# Altium project fMUX_MB.PrjPCB (part 1 of 6)
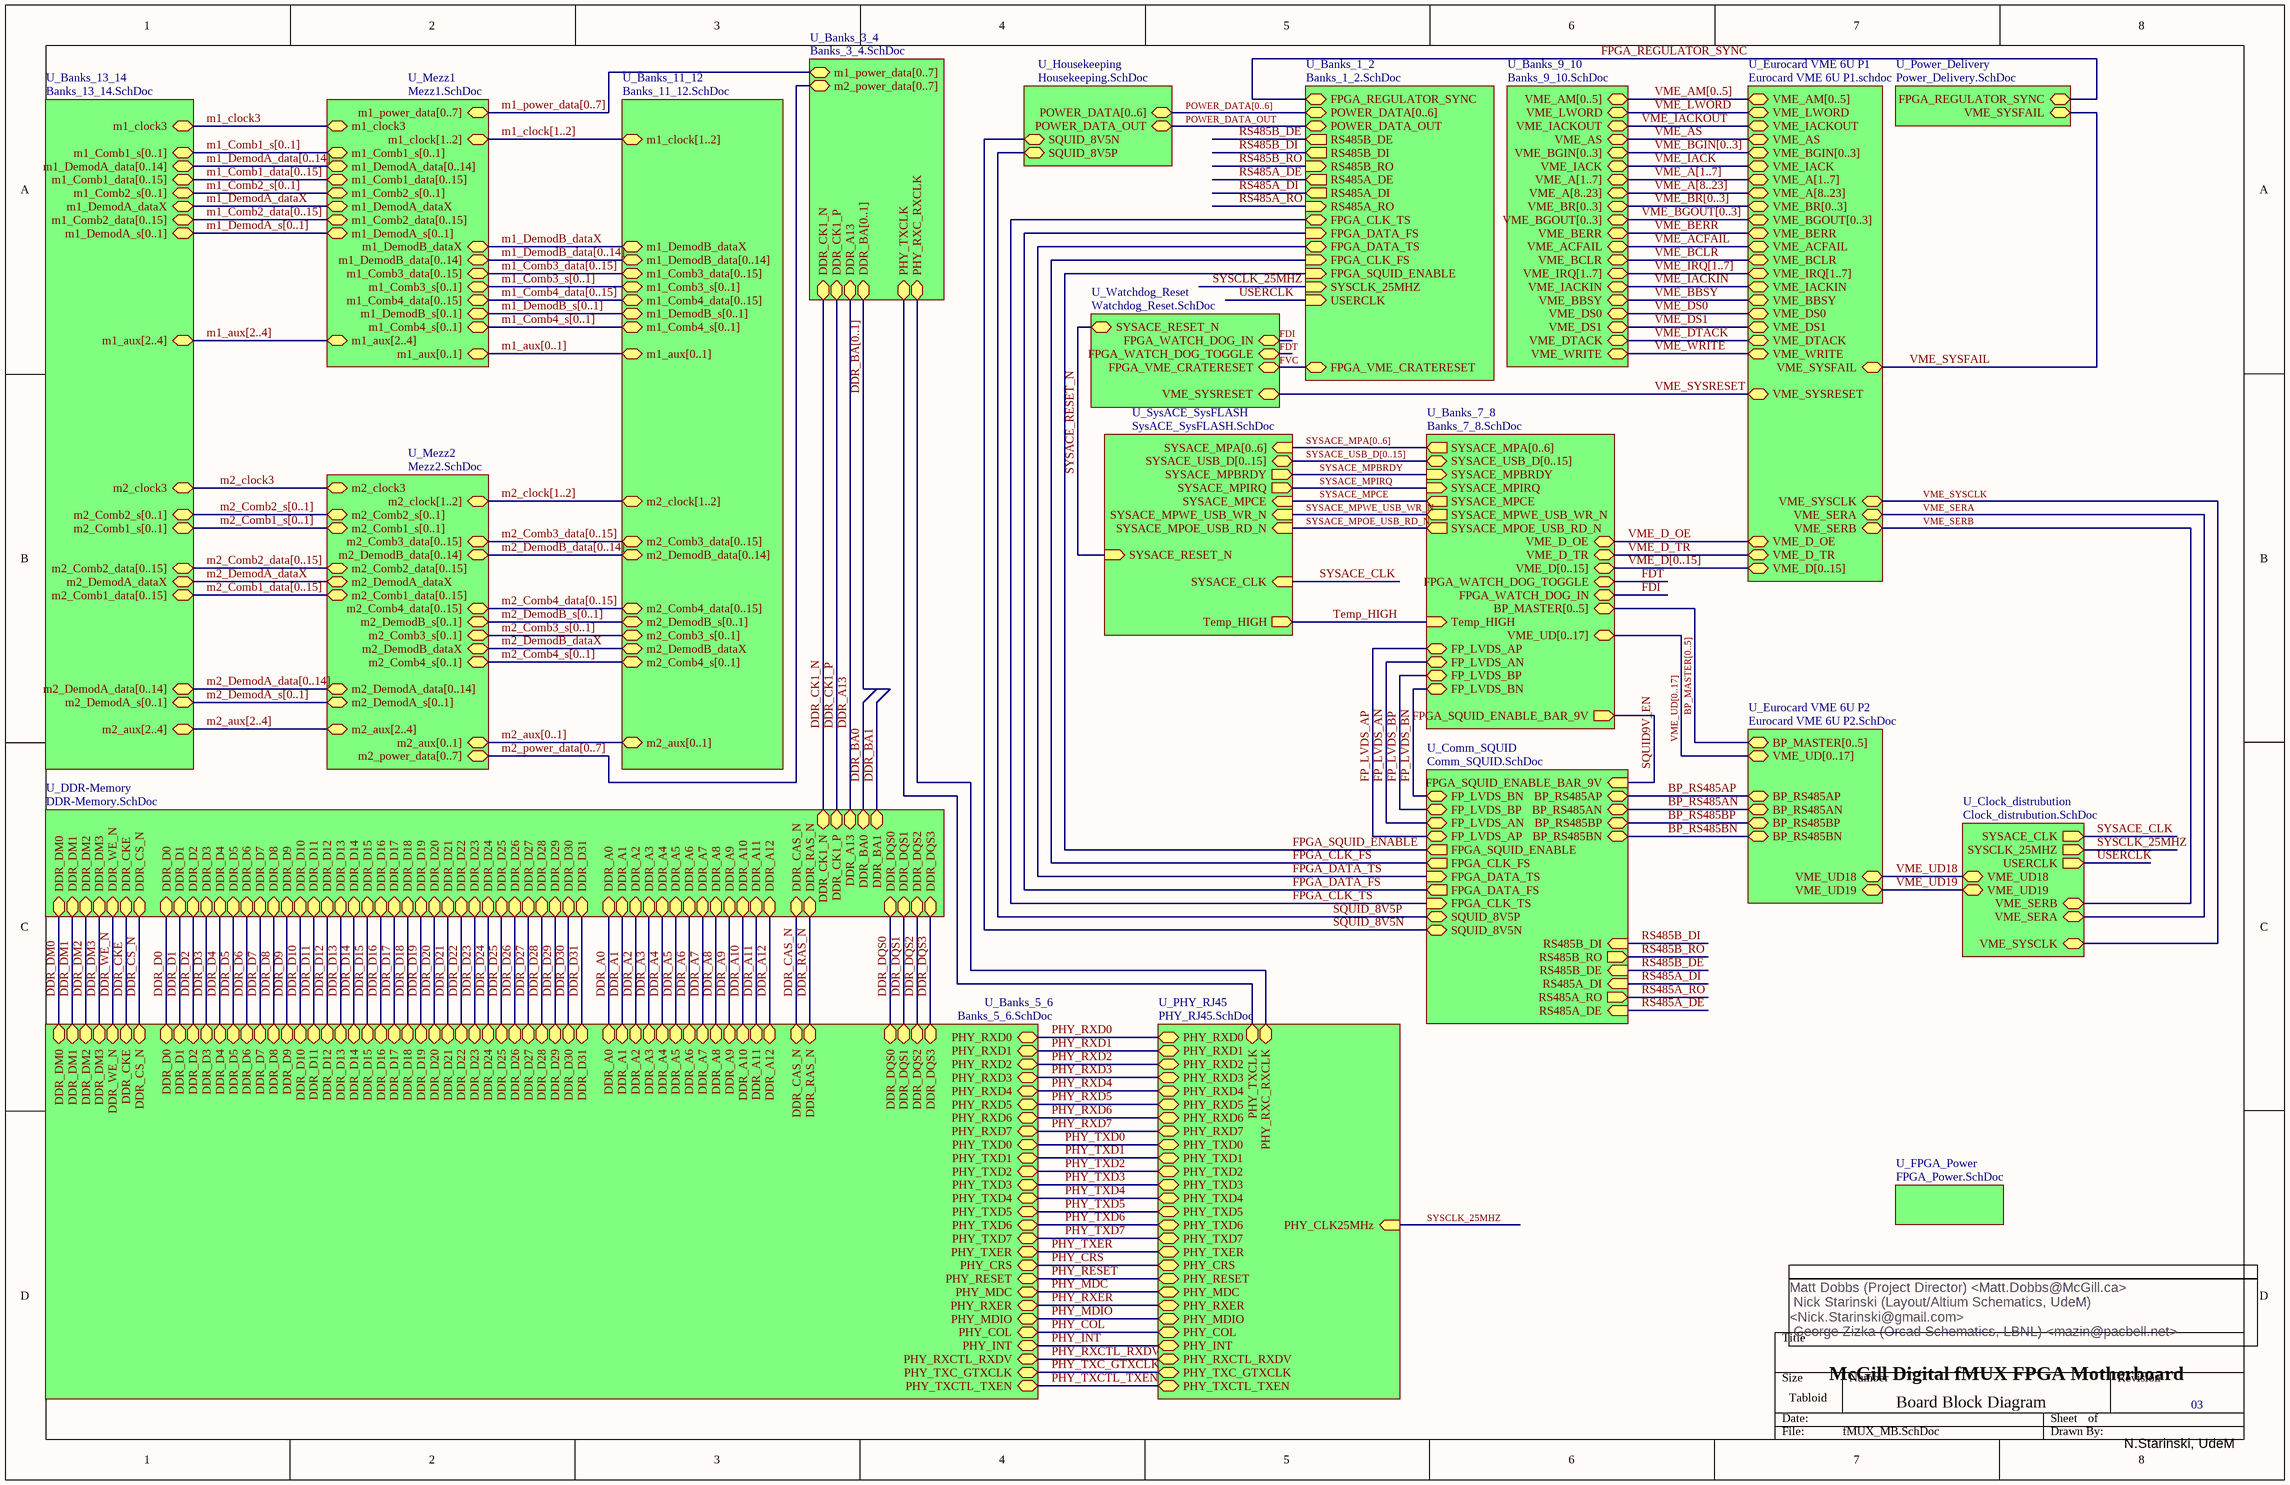
[diagram p0: fMUX_MB.SchDoc]
28 sheets, 672 parts. Net scope: hierarchical (ports join the sheet entries above them; power ports are global).
Board file: fMAX_MB.PcbDoc
Sheets:
  fMUX_MB.SchDoc
    U_Banks_1_2 = Banks_1_2.SchDoc
    U_Banks_3_4 = Banks_3_4.SchDoc
    U_Banks_5_6 = Banks_5_6.SchDoc
    U_Banks_7_8 = Banks_7_8.SchDoc
    U_Banks_9_10 = Banks_9_10.SchDoc
    U_Banks_11_12 = Banks_11_12.SchDoc
    U_Banks_13_14 = Banks_13_14.SchDoc
    U_Power_Delivery = Power_Delivery.SchDoc
      BuckRegulator1 = Buck_regulator.SchDoc
      BuckRegulator2 = Buck_regulator.SchDoc
      BuckRegulator3 = Buck_regulator.SchDoc
      Liner_Pos_Regulator = Linear_Pos_regulator.SchDoc
    U_Clock_distrubution = Clock_distrubution.SchDoc
      UserCLK = UserClock.SchDoc
    U_DDR-Memory = DDR-Memory.SchDoc
      RTerm1 = RTerm.SchDoc
      RTerm2 = RTerm.SchDoc
      RTerm3 = RTerm.SchDoc
      RTerm4 = RTerm.SchDoc
      RTerm5 = RTerm.SchDoc
      RTerm6 = RTerm.SchDoc
      RTerm7 = RTerm.SchDoc
      RTerm8 = RTerm.SchDoc
    U_Eurocard VME 6U P1 = Eurocard VME 6U P1.schdoc
    U_Eurocard VME 6U P2 = Eurocard VME 6U P2.SchDoc
    U_FPGA_Power = FPGA_Power.SchDoc
    U_Housekeeping = Housekeeping.SchDoc
      TemperatureSens1 = TermperatureSens.SchDoc
      TemperatureSens2 = TermperatureSens.SchDoc
      TemperatureSens3 = TermperatureSens.SchDoc
    U_Mezz1 = Mezz1.SchDoc
    U_Mezz2 = Mezz2.SchDoc
    U_SysACE_SysFLASH = SysACE_SysFLASH.SchDoc
    U_Watchdog_Reset = Watchdog_Reset.SchDoc
    U_Comm_SQUID = Comm_SQUID.SchDoc
      U_SQUID_Power = SQUID_Power.SchDoc
    U_PHY_RJ45 = PHY_RJ45.SchDoc
  fMuxBoardOverview.SchDoc

## Sheet fMUX_MB.SchDoc: FPGA Motherboard for Digital Multiplexed Readout, McGill U.
size Tabloid; DocumentNumber: DfMUX1; Revision: Rev0, Prototype; SheetNumber: 1; SheetTotal: 27; PageSetup: Record=PageOptions|CenterHorizontal=True|CenterVertical=True|PrintScale=0.72|XCorrection=1.00|YCorrection=1.00|PrintKind=0|BorderSize=5000000|LeftOffset=0|BottomOffset=0|Orientation=2|PaperLength=1000|PaperWidth=1000|Scale=100|PaperSource=7|PrintQuality=-4|MediaType=1|DitherType=10|PaperKind=Letter|PrintScaleMode=1

### Sub-sheets
U_Banks_1_2 = Banks_1_2.SchDoc: POWER_DATA[0..6], POWER_DATA_OUT (bidir), RS485B_RO (in), RS485B_DE (out), FPGA_SQUID_ENABLE (in), SYSCLK_25MHZ (in), USERCLK (in), FPGA_VME_CRATERESET (bidir), RS485A_DE (out), FPGA_REGULATOR_SYNC (bidir), FPGA_DATA_FS (in), FPGA_CLK_TS (bidir), FPGA_DATA_TS (bidir), RS485A_DI (out), FPGA_CLK_FS (in), RS485B_DI (out), RS485A_RO (in)
U_Banks_3_4 = Banks_3_4.SchDoc: m1_power_data[0..7], m2_power_data[0..7] (bidir), DDR_A13 (bidir), DDR_CK1_P (bidir), PHY_TXCLK (bidir), DDR_CK1_N (bidir), PHY_RXC_RXCLK (bidir), DDR_BA[0..1] (bidir)
U_Banks_5_6 = Banks_5_6.SchDoc: DDR_D0 (bidir), DDR_D2 (bidir), DDR_D6 (bidir), DDR_D3 (bidir), DDR_D8 (bidir), DDR_D1 (bidir), DDR_D9 (bidir), DDR_D7 (bidir), DDR_D11 (bidir), DDR_D12 (bidir), DDR_D13 (bidir), DDR_D29 (bidir), DDR_A1 (bidir), DDR_D4 (bidir), DDR_D5 (bidir), DDR_D16 (bidir), DDR_DQS3 (bidir), DDR_DM2 (bidir), DDR_DQS2 (bidir), DDR_D15 (bidir), DDR_D18 (bidir), DDR_D19 (bidir), DDR_D20 (bidir), DDR_A7 (bidir), DDR_A8 (bidir), DDR_A11 (bidir), DDR_D10 (bidir), DDR_D17 (bidir), DDR_A12 (bidir), DDR_DM0 (bidir), DDR_DQS1 (bidir), DDR_A2 (bidir), DDR_CAS_N (bidir), DDR_A9 (bidir), DDR_DM3 (bidir), DDR_DQS0 (bidir), DDR_RAS_N (bidir), DDR_DM1 (bidir), DDR_D14 (bidir), DDR_A4 (bidir), DDR_A5 (bidir), DDR_A10 (bidir), DDR_WE_N (bidir), DDR_D21 (bidir), DDR_D22 (bidir), DDR_D23 (bidir), DDR_D24 (bidir), DDR_A6 (bidir), DDR_A3 (bidir), DDR_D26 (bidir), DDR_D31 (bidir), DDR_A0 (bidir), DDR_D27 (bidir), DDR_D28 (bidir), DDR_D30 (bidir), DDR_D25 (bidir), PHY_TXD6 (bidir), PHY_RXD0 (bidir), PHY_RXD2 (bidir), PHY_RXD7 (bidir), PHY_MDIO (bidir), PHY_TXCTL_TXEN (bidir), PHY_RXD4 (bidir), PHY_RXD5 (bidir), PHY_RXD6 (bidir), PHY_TXER (bidir), PHY_MDC (bidir), PHY_COL (bidir), PHY_RXD3 (bidir), PHY_RXER (bidir), PHY_TXD1 (bidir), PHY_TXD3 (bidir), PHY_RXD1 (bidir), PHY_RXCTL_RXDV (bidir), PHY_CRS (bidir), PHY_TXC_GTXCLK (bidir), PHY_RESET (bidir), PHY_TXD0 (bidir), PHY_TXD5 (bidir), PHY_TXD2 (bidir), PHY_TXD4 (bidir), PHY_TXD7 (bidir), PHY_INT (bidir), DDR_CS_N (bidir), DDR_CKE (bidir)
U_Banks_7_8 = Banks_7_8.SchDoc: BP_MASTER[0..5], FP_LVDS_BP (bidir), VME_D[0..15] (bidir), FP_LVDS_BN (bidir), FP_LVDS_AP (bidir), FP_LVDS_AN (bidir), VME_UD[0..17] (bidir), SYSACE_MPA[0..6] (out), SYSACE_USB_D[0..15], VME_D_OE (bidir), SYSACE_MPIRQ (in), SYSACE_MPCE (out), VME_D_TR (bidir), SYSACE_MPBRDY (in), SYSACE_MPOE_USB_RD_N (out), SYSACE_MPWE_USB_WR_N (out), Temp_HIGH (in), FPGA_WATCH_DOG_TOGGLE (bidir), FPGA_WATCH_DOG_IN (bidir), FPGA_SQUID_ENABLE_BAR_9V (out)
U_Banks_9_10 = Banks_9_10.SchDoc: VME_AM[0..5] (bidir), VME_LWORD (bidir), VME_IACKOUT (bidir), VME_AS (bidir), VME_BGIN[0..3] (bidir), VME_IACK (bidir), VME_A[8..23] (bidir), VME_BR[0..3] (bidir), VME_BGOUT[0..3] (bidir), VME_BERR (bidir), VME_A[1..7] (bidir), VME_ACFAIL (bidir), VME_BCLR (bidir), VME_IRQ[1..7] (bidir), VME_IACKIN (bidir), VME_BBSY (bidir), VME_DS0 (bidir), VME_DS1 (bidir), VME_DTACK (bidir), VME_WRITE (bidir)
U_Banks_11_12 = Banks_11_12.SchDoc: m1_Comb3_s[0..1] (bidir), m2_Comb3_s[0..1] (bidir), m1_Comb4_s[0..1] (bidir), m2_Comb4_s[0..1] (bidir), m2_DemodB_data[0..14] (bidir), m1_DemodB_data[0..14] (bidir), m1_Comb4_data[0..15] (bidir), m1_Comb3_data[0..15] (bidir), m2_Comb3_data[0..15] (bidir), m2_Comb4_data[0..15] (bidir), m2_aux[0..1] (bidir), m1_DemodB_s[0..1] (bidir), m2_DemodB_s[0..1] (bidir), m1_clock[1..2] (bidir), m1_DemodB_dataX (bidir), m2_DemodB_dataX (bidir), m2_clock[1..2] (bidir), m1_aux[0..1] (bidir)
U_Banks_13_14 = Banks_13_14.SchDoc: m2_DemodA_s[0..1] (bidir), m1_clock3 (bidir), m1_DemodA_data[0..14] (bidir), m2_Comb1_data[0..15] (bidir), m1_DemodA_s[0..1] (bidir), m1_Comb2_data[0..15] (bidir), m2_Comb1_s[0..1] (bidir), m1_aux[2..4] (bidir), m2_Comb2_data[0..15] (bidir), m2_Comb2_s[0..1] (bidir), m2_aux[2..4] (bidir), m1_Comb1_data[0..15] (bidir), m1_Comb2_s[0..1] (bidir), m1_Comb1_s[0..1] (bidir), m1_DemodA_dataX (bidir), m2_DemodA_dataX (bidir), m2_DemodA_data[0..14] (bidir), m2_clock3 (bidir)
U_Clock_distrubution = Clock_distrubution.SchDoc: SYSACE_CLK (out), SYSCLK_25MHZ (out), USERCLK (out), VME_UD18 (bidir), VME_UD19 (bidir), VME_SYSCLK (bidir), VME_SERA (bidir), VME_SERB (bidir)
U_Comm_SQUID = Comm_SQUID.SchDoc: BP_RS485BP (bidir), BP_RS485BN (bidir), BP_RS485AP (bidir), BP_RS485AN (bidir), FP_LVDS_BN (bidir), FP_LVDS_BP (bidir), FP_LVDS_AN (bidir), FP_LVDS_AP (bidir), FPGA_CLK_TS (in), FPGA_DATA_FS (out), FPGA_CLK_FS (out), SQUID_8V5N, FPGA_DATA_TS (in), RS485B_DE (in), RS485B_RO (out), RS485A_DE (in), RS485A_RO (out), SQUID_8V5P, RS485A_DI (in), FPGA_SQUID_ENABLE (out), RS485B_DI (in), FPGA_SQUID_ENABLE_BAR_9V (in)
U_DDR-Memory = DDR-Memory.SchDoc: DDR_A11 (bidir), DDR_D27 (bidir), DDR_D7 (bidir), DDR_A8 (bidir), DDR_D25 (bidir), DDR_A7 (bidir), DDR_A6 (bidir), DDR_DM0 (bidir), DDR_DM1 (bidir), DDR_D20 (bidir), DDR_DQS2 (bidir), DDR_DQS3 (bidir), DDR_D16 (bidir), DDR_D8 (bidir), DDR_D13 (bidir), DDR_D0 (bidir), DDR_A4 (bidir), DDR_D19 (bidir), DDR_A2 (bidir), DDR_A12 (bidir), DDR_D28 (bidir), DDR_D30 (bidir), DDR_A13 (bidir), DDR_A5 (bidir), DDR_D10 (bidir), DDR_A10 (bidir), DDR_D12 (bidir), DDR_D31 (bidir), DDR_DM3 (bidir), DDR_D14 (bidir), DDR_D29 (bidir), DDR_D21 (bidir), DDR_D24 (bidir), DDR_D6 (bidir), DDR_D11 (bidir), DDR_D5 (bidir), DDR_D15 (bidir), DDR_D4 (bidir), DDR_D18 (bidir), DDR_D2 (bidir), DDR_D9 (bidir), DDR_A3 (bidir), DDR_A0 (bidir), DDR_CK1_N (bidir), DDR_D3 (bidir), DDR_D23 (bidir), DDR_D26 (bidir), DDR_D17 (bidir), DDR_A1 (bidir), DDR_DM2 (bidir), DDR_A9 (bidir), DDR_D1 (bidir), DDR_BA0 (bidir), DDR_DQS1 (bidir), DDR_CAS_N (bidir), DDR_CS_N (bidir), DDR_CKE (bidir), DDR_WE_N (bidir), DDR_BA1 (bidir), DDR_D22 (bidir), DDR_DQS0 (bidir), DDR_CK1_P (bidir), DDR_RAS_N (bidir)
U_Eurocard VME 6U P1 = Eurocard VME 6U P1.schdoc: VME_DTACK (bidir), VME_BGIN[0..3] (bidir), VME_BCLR (bidir), VME_IACKIN (bidir), VME_BGOUT[0..3] (bidir), VME_IRQ[1..7] (bidir), VME_BBSY (bidir), VME_BR[0..3] (bidir), VME_DS1 (bidir), VME_ACFAIL (bidir), VME_A[1..7] (bidir), VME_IACK (bidir), VME_AM[0..5] (bidir), VME_D[0..15] (bidir), VME_BERR (bidir), VME_LWORD (bidir), VME_IACKOUT (bidir), VME_A[8..23] (bidir), VME_WRITE (bidir), VME_AS (bidir), VME_DS0 (bidir), VME_SYSFAIL (bidir), VME_D_OE (bidir), VME_SYSRESET (bidir), VME_D_TR (bidir), VME_SYSCLK (bidir), VME_SERA (bidir), VME_SERB (bidir)
U_Eurocard VME 6U P2 = Eurocard VME 6U P2.SchDoc: BP_RS485BN (bidir), BP_MASTER[0..5], BP_RS485BP (bidir), BP_RS485AN (bidir), BP_RS485AP (bidir), VME_UD[0..17] (bidir), VME_UD18 (bidir), VME_UD19 (bidir)
U_FPGA_Power = FPGA_Power.SchDoc: no entries
U_Housekeeping = Housekeeping.SchDoc: POWER_DATA[0..6], POWER_DATA_OUT (bidir), SQUID_8V5N, SQUID_8V5P
U_Mezz1 = Mezz1.SchDoc: m1_power_data[0..7], m1_Comb1_s[0..1] (bidir), m1_DemodA_data[0..14] (bidir), m1_Comb1_data[0..15] (bidir), m1_DemodB_data[0..14] (bidir), m1_DemodB_dataX (bidir), m1_Comb4_s[0..1] (bidir), m1_Comb2_data[0..15] (bidir), m1_DemodB_s[0..1] (bidir), m1_DemodA_s[0..1] (bidir), m1_DemodA_dataX (bidir), m1_Comb3_data[0..15] (bidir), m1_Comb2_s[0..1] (bidir), m1_Comb3_s[0..1] (bidir), m1_Comb4_data[0..15] (bidir), m1_aux[2..4] (bidir), m1_clock[1..2] (bidir), m1_clock3 (bidir), m1_aux[0..1] (bidir)
U_Mezz2 = Mezz2.SchDoc: m2_power_data[0..7] (bidir), m2_Comb3_s[0..1] (bidir), m2_Comb2_data[0..15] (bidir), m2_DemodA_s[0..1] (bidir), m2_Comb4_s[0..1] (bidir), m2_Comb4_data[0..15] (bidir), m2_DemodB_s[0..1] (bidir), m2_DemodA_data[0..14] (bidir), m2_Comb2_s[0..1] (bidir), m2_Comb3_data[0..15] (bidir), m2_DemodB_data[0..14] (bidir), m2_Comb1_data[0..15] (bidir), m2_Comb1_s[0..1] (bidir), m2_DemodA_dataX (bidir), m2_DemodB_dataX (bidir), m2_clock[1..2] (bidir), m2_aux[2..4] (bidir), m2_clock3 (bidir), m2_aux[0..1] (bidir)
U_PHY_RJ45 = PHY_RJ45.SchDoc: PHY_RXD3 (bidir), PHY_RXD4 (bidir), PHY_RXD0 (bidir), PHY_RXD5 (bidir), PHY_RXD1 (bidir), PHY_RXD7 (bidir), PHY_RXD6 (bidir), PHY_RXD2 (bidir), PHY_RXC_RXCLK (bidir), PHY_TXCLK (bidir), PHY_TXD3 (bidir), PHY_TXD5 (bidir), PHY_MDC (bidir), PHY_TXER (bidir), PHY_CRS (bidir), PHY_TXC_GTXCLK (bidir), PHY_RXCTL_RXDV (bidir), PHY_TXCTL_TXEN (bidir), PHY_COL (bidir), PHY_TXD4 (bidir), PHY_TXD7 (bidir), PHY_RESET (bidir), PHY_INT (bidir), PHY_TXD2 (bidir), PHY_TXD1 (bidir), PHY_TXD6 (bidir), PHY_RXER (bidir), PHY_MDIO (bidir), PHY_TXD0 (bidir), PHY_CLK25MHz (in)
U_Power_Delivery = Power_Delivery.SchDoc: FPGA_REGULATOR_SYNC (bidir), VME_SYSFAIL (bidir)
U_SysACE_SysFLASH = SysACE_SysFLASH.SchDoc: SYSACE_MPCE (in), SYSACE_USB_D[0..15], SYSACE_MPIRQ (out), SYSACE_MPA[0..6] (in), SYSACE_MPBRDY (out), SYSACE_MPWE_USB_WR_N (in), SYSACE_MPOE_USB_RD_N (in), SYSACE_RESET_N (in), SYSACE_CLK (in), Temp_HIGH (out)
U_Watchdog_Reset = Watchdog_Reset.SchDoc: SYSACE_RESET_N (bidir), FPGA_WATCH_DOG_TOGGLE (bidir), VME_SYSRESET (bidir), FPGA_VME_CRATERESET (bidir), FPGA_WATCH_DOG_IN (bidir)

### Nets
BP_RS485AN: sheet U_Eurocard VME 6U P2/BP_RS485AN, sheet U_Comm_SQUID/BP_RS485AN
BP_RS485AP: sheet U_Eurocard VME 6U P2/BP_RS485AP, sheet U_Comm_SQUID/BP_RS485AP
BP_RS485BN: sheet U_Eurocard VME 6U P2/BP_RS485BN, sheet U_Comm_SQUID/BP_RS485BN
BP_RS485BP: sheet U_Eurocard VME 6U P2/BP_RS485BP, sheet U_Comm_SQUID/BP_RS485BP
DDR_A0: sheet U_Banks_5_6/DDR_A0, sheet U_DDR-Memory/DDR_A0
DDR_A1: sheet U_Banks_5_6/DDR_A1, sheet U_DDR-Memory/DDR_A1
DDR_A2: sheet U_Banks_5_6/DDR_A2, sheet U_DDR-Memory/DDR_A2
DDR_A3: sheet U_Banks_5_6/DDR_A3, sheet U_DDR-Memory/DDR_A3
DDR_A4: sheet U_Banks_5_6/DDR_A4, sheet U_DDR-Memory/DDR_A4
DDR_A5: sheet U_Banks_5_6/DDR_A5, sheet U_DDR-Memory/DDR_A5
DDR_A6: sheet U_Banks_5_6/DDR_A6, sheet U_DDR-Memory/DDR_A6
DDR_A7: sheet U_Banks_5_6/DDR_A7, sheet U_DDR-Memory/DDR_A7
DDR_A8: sheet U_Banks_5_6/DDR_A8, sheet U_DDR-Memory/DDR_A8
DDR_A9: sheet U_Banks_5_6/DDR_A9, sheet U_DDR-Memory/DDR_A9
DDR_A10: sheet U_Banks_5_6/DDR_A10, sheet U_DDR-Memory/DDR_A10
DDR_A11: sheet U_Banks_5_6/DDR_A11, sheet U_DDR-Memory/DDR_A11
DDR_A12: sheet U_Banks_5_6/DDR_A12, sheet U_DDR-Memory/DDR_A12
DDR_A13: sheet U_Banks_3_4/DDR_A13, sheet U_DDR-Memory/DDR_A13
DDR_CAS_N: sheet U_Banks_5_6/DDR_CAS_N, sheet U_DDR-Memory/DDR_CAS_N
DDR_CK1_N: sheet U_Banks_3_4/DDR_CK1_N, sheet U_DDR-Memory/DDR_CK1_N
DDR_CK1_P: sheet U_Banks_3_4/DDR_CK1_P, sheet U_DDR-Memory/DDR_CK1_P
DDR_CKE: sheet U_Banks_5_6/DDR_CKE, sheet U_DDR-Memory/DDR_CKE
DDR_CS_N: sheet U_Banks_5_6/DDR_CS_N, sheet U_DDR-Memory/DDR_CS_N
DDR_D0: sheet U_Banks_5_6/DDR_D0, sheet U_DDR-Memory/DDR_D0
DDR_D1: sheet U_Banks_5_6/DDR_D1, sheet U_DDR-Memory/DDR_D1
DDR_D2: sheet U_Banks_5_6/DDR_D2, sheet U_DDR-Memory/DDR_D2
DDR_D3: sheet U_Banks_5_6/DDR_D3, sheet U_DDR-Memory/DDR_D3
DDR_D4: sheet U_Banks_5_6/DDR_D4, sheet U_DDR-Memory/DDR_D4
DDR_D5: sheet U_Banks_5_6/DDR_D5, sheet U_DDR-Memory/DDR_D5
DDR_D6: sheet U_Banks_5_6/DDR_D6, sheet U_DDR-Memory/DDR_D6
DDR_D7: sheet U_Banks_5_6/DDR_D7, sheet U_DDR-Memory/DDR_D7
DDR_D8: sheet U_Banks_5_6/DDR_D8, sheet U_DDR-Memory/DDR_D8
DDR_D9: sheet U_Banks_5_6/DDR_D9, sheet U_DDR-Memory/DDR_D9
DDR_D10: sheet U_Banks_5_6/DDR_D10, sheet U_DDR-Memory/DDR_D10
DDR_D11: sheet U_Banks_5_6/DDR_D11, sheet U_DDR-Memory/DDR_D11
DDR_D12: sheet U_Banks_5_6/DDR_D12, sheet U_DDR-Memory/DDR_D12
DDR_D13: sheet U_Banks_5_6/DDR_D13, sheet U_DDR-Memory/DDR_D13
DDR_D14: sheet U_Banks_5_6/DDR_D14, sheet U_DDR-Memory/DDR_D14
DDR_D15: sheet U_Banks_5_6/DDR_D15, sheet U_DDR-Memory/DDR_D15
DDR_D16: sheet U_Banks_5_6/DDR_D16, sheet U_DDR-Memory/DDR_D16
DDR_D17: sheet U_Banks_5_6/DDR_D17, sheet U_DDR-Memory/DDR_D17
DDR_D18: sheet U_Banks_5_6/DDR_D18, sheet U_DDR-Memory/DDR_D18
DDR_D19: sheet U_Banks_5_6/DDR_D19, sheet U_DDR-Memory/DDR_D19
DDR_D20: sheet U_Banks_5_6/DDR_D20, sheet U_DDR-Memory/DDR_D20
DDR_D21: sheet U_Banks_5_6/DDR_D21, sheet U_DDR-Memory/DDR_D21
DDR_D22: sheet U_Banks_5_6/DDR_D22, sheet U_DDR-Memory/DDR_D22
DDR_D23: sheet U_Banks_5_6/DDR_D23, sheet U_DDR-Memory/DDR_D23
DDR_D24: sheet U_Banks_5_6/DDR_D24, sheet U_DDR-Memory/DDR_D24
DDR_D25: sheet U_Banks_5_6/DDR_D25, sheet U_DDR-Memory/DDR_D25
DDR_D26: sheet U_Banks_5_6/DDR_D26, sheet U_DDR-Memory/DDR_D26
DDR_D27: sheet U_Banks_5_6/DDR_D27, sheet U_DDR-Memory/DDR_D27
DDR_D28: sheet U_Banks_5_6/DDR_D28, sheet U_DDR-Memory/DDR_D28
DDR_D29: sheet U_Banks_5_6/DDR_D29, sheet U_DDR-Memory/DDR_D29
DDR_D30: sheet U_Banks_5_6/DDR_D30, sheet U_DDR-Memory/DDR_D30
DDR_D31: sheet U_Banks_5_6/DDR_D31, sheet U_DDR-Memory/DDR_D31
DDR_DM0: sheet U_Banks_5_6/DDR_DM0, sheet U_DDR-Memory/DDR_DM0
DDR_DM1: sheet U_Banks_5_6/DDR_DM1, sheet U_DDR-Memory/DDR_DM1
DDR_DM2: sheet U_Banks_5_6/DDR_DM2, sheet U_DDR-Memory/DDR_DM2
DDR_DM3: sheet U_Banks_5_6/DDR_DM3, sheet U_DDR-Memory/DDR_DM3
DDR_DQS0: sheet U_Banks_5_6/DDR_DQS0, sheet U_DDR-Memory/DDR_DQS0
DDR_DQS1: sheet U_Banks_5_6/DDR_DQS1, sheet U_DDR-Memory/DDR_DQS1
DDR_DQS2: sheet U_Banks_5_6/DDR_DQS2, sheet U_DDR-Memory/DDR_DQS2
DDR_DQS3: sheet U_Banks_5_6/DDR_DQS3, sheet U_DDR-Memory/DDR_DQS3
DDR_RAS_N: sheet U_Banks_5_6/DDR_RAS_N, sheet U_DDR-Memory/DDR_RAS_N
DDR_WE_N: sheet U_Banks_5_6/DDR_WE_N, sheet U_DDR-Memory/DDR_WE_N
FDI: sheet U_Banks_7_8/FPGA_WATCH_DOG_IN, sheet U_Watchdog_Reset/FPGA_WATCH_DOG_IN
FDT: sheet U_Banks_7_8/FPGA_WATCH_DOG_TOGGLE, sheet U_Watchdog_Reset/FPGA_WATCH_DOG_TOGGLE
FP_LVDS_AN: sheet U_Banks_7_8/FP_LVDS_AN, sheet U_Comm_SQUID/FP_LVDS_AN
FP_LVDS_AP: sheet U_Banks_7_8/FP_LVDS_AP, sheet U_Comm_SQUID/FP_LVDS_AP
FP_LVDS_BN: sheet U_Banks_7_8/FP_LVDS_BN, sheet U_Comm_SQUID/FP_LVDS_BN
FP_LVDS_BP: sheet U_Banks_7_8/FP_LVDS_BP, sheet U_Comm_SQUID/FP_LVDS_BP
FPGA_CLK_FS: sheet U_Banks_1_2/FPGA_CLK_FS, sheet U_Comm_SQUID/FPGA_CLK_FS
FPGA_CLK_TS: sheet U_Banks_1_2/FPGA_CLK_TS, sheet U_Comm_SQUID/FPGA_CLK_TS
FPGA_DATA_FS: sheet U_Banks_1_2/FPGA_DATA_FS, sheet U_Comm_SQUID/FPGA_DATA_FS
FPGA_DATA_TS: sheet U_Banks_1_2/FPGA_DATA_TS, sheet U_Comm_SQUID/FPGA_DATA_TS
FPGA_REGULATOR_SYNC: sheet U_Banks_1_2/FPGA_REGULATOR_SYNC, sheet U_Power_Delivery/FPGA_REGULATOR_SYNC
FPGA_SQUID_ENABLE: sheet U_Banks_1_2/FPGA_SQUID_ENABLE, sheet U_Comm_SQUID/FPGA_SQUID_ENABLE
FVC: sheet U_Banks_1_2/FPGA_VME_CRATERESET, sheet U_Watchdog_Reset/FPGA_VME_CRATERESET
m1_clock3: sheet U_Banks_13_14/m1_clock3, sheet U_Mezz1/m1_clock3
m1_DemodA_dataX: sheet U_Banks_13_14/m1_DemodA_dataX, sheet U_Mezz1/m1_DemodA_dataX
m1_DemodB_dataX: sheet U_Banks_11_12/m1_DemodB_dataX, sheet U_Mezz1/m1_DemodB_dataX
m2_clock3: sheet U_Banks_13_14/m2_clock3, sheet U_Mezz2/m2_clock3
m2_DemodA_dataX: sheet U_Banks_13_14/m2_DemodA_dataX, sheet U_Mezz2/m2_DemodA_dataX
m2_DemodB_dataX: sheet U_Banks_11_12/m2_DemodB_dataX, sheet U_Mezz2/m2_DemodB_dataX
PHY_COL: sheet U_Banks_5_6/PHY_COL, sheet U_PHY_RJ45/PHY_COL
PHY_CRS: sheet U_Banks_5_6/PHY_CRS, sheet U_PHY_RJ45/PHY_CRS
PHY_INT: sheet U_Banks_5_6/PHY_INT, sheet U_PHY_RJ45/PHY_INT
PHY_MDC: sheet U_Banks_5_6/PHY_MDC, sheet U_PHY_RJ45/PHY_MDC
PHY_MDIO: sheet U_Banks_5_6/PHY_MDIO, sheet U_PHY_RJ45/PHY_MDIO
PHY_RESET: sheet U_Banks_5_6/PHY_RESET, sheet U_PHY_RJ45/PHY_RESET
PHY_RXCTL_RXDV: sheet U_Banks_5_6/PHY_RXCTL_RXDV, sheet U_PHY_RJ45/PHY_RXCTL_RXDV
PHY_RXD0: sheet U_Banks_5_6/PHY_RXD0, sheet U_PHY_RJ45/PHY_RXD0
PHY_RXD1: sheet U_Banks_5_6/PHY_RXD1, sheet U_PHY_RJ45/PHY_RXD1
PHY_RXD2: sheet U_Banks_5_6/PHY_RXD2, sheet U_PHY_RJ45/PHY_RXD2
PHY_RXD3: sheet U_Banks_5_6/PHY_RXD3, sheet U_PHY_RJ45/PHY_RXD3
PHY_RXD4: sheet U_Banks_5_6/PHY_RXD4, sheet U_PHY_RJ45/PHY_RXD4
PHY_RXD5: sheet U_Banks_5_6/PHY_RXD5, sheet U_PHY_RJ45/PHY_RXD5
PHY_RXD6: sheet U_Banks_5_6/PHY_RXD6, sheet U_PHY_RJ45/PHY_RXD6
PHY_RXD7: sheet U_Banks_5_6/PHY_RXD7, sheet U_PHY_RJ45/PHY_RXD7
PHY_RXER: sheet U_Banks_5_6/PHY_RXER, sheet U_PHY_RJ45/PHY_RXER
PHY_TXC_GTXCLK: sheet U_Banks_5_6/PHY_TXC_GTXCLK, sheet U_PHY_RJ45/PHY_TXC_GTXCLK
PHY_TXCTL_TXEN: sheet U_Banks_5_6/PHY_TXCTL_TXEN, sheet U_PHY_RJ45/PHY_TXCTL_TXEN
PHY_TXD0: sheet U_Banks_5_6/PHY_TXD0, sheet U_PHY_RJ45/PHY_TXD0
PHY_TXD1: sheet U_Banks_5_6/PHY_TXD1, sheet U_PHY_RJ45/PHY_TXD1
PHY_TXD2: sheet U_Banks_5_6/PHY_TXD2, sheet U_PHY_RJ45/PHY_TXD2
PHY_TXD3: sheet U_Banks_5_6/PHY_TXD3, sheet U_PHY_RJ45/PHY_TXD3
PHY_TXD4: sheet U_Banks_5_6/PHY_TXD4, sheet U_PHY_RJ45/PHY_TXD4
PHY_TXD5: sheet U_Banks_5_6/PHY_TXD5, sheet U_PHY_RJ45/PHY_TXD5
PHY_TXD6: sheet U_Banks_5_6/PHY_TXD6, sheet U_PHY_RJ45/PHY_TXD6
PHY_TXD7: sheet U_Banks_5_6/PHY_TXD7, sheet U_PHY_RJ45/PHY_TXD7
PHY_TXER: sheet U_Banks_5_6/PHY_TXER, sheet U_PHY_RJ45/PHY_TXER
POWER_DATA_OUT: sheet U_Banks_1_2/POWER_DATA_OUT, sheet U_Housekeeping/POWER_DATA_OUT
RS485A_DE: sheet U_Banks_1_2/RS485A_DE, sheet U_Comm_SQUID/RS485A_DE
RS485A_DI: sheet U_Banks_1_2/RS485A_DI, sheet U_Comm_SQUID/RS485A_DI
RS485A_RO: sheet U_Banks_1_2/RS485A_RO, sheet U_Comm_SQUID/RS485A_RO
RS485B_DE: sheet U_Banks_1_2/RS485B_DE, sheet U_Comm_SQUID/RS485B_DE
RS485B_DI: sheet U_Banks_1_2/RS485B_DI, sheet U_Comm_SQUID/RS485B_DI
RS485B_RO: sheet U_Banks_1_2/RS485B_RO, sheet U_Comm_SQUID/RS485B_RO
SQUID9V_EN: sheet U_Banks_7_8/FPGA_SQUID_ENABLE_BAR_9V, sheet U_Comm_SQUID/FPGA_SQUID_ENABLE_BAR_9V
SQUID_8V5N: sheet U_Housekeeping/SQUID_8V5N, sheet U_Comm_SQUID/SQUID_8V5N
SQUID_8V5P: sheet U_Housekeeping/SQUID_8V5P, sheet U_Comm_SQUID/SQUID_8V5P
SYSACE_CLK: sheet U_Clock_distrubution/SYSACE_CLK, sheet U_SysACE_SysFLASH/SYSACE_CLK
SYSACE_MPBRDY: sheet U_Banks_7_8/SYSACE_MPBRDY, sheet U_SysACE_SysFLASH/SYSACE_MPBRDY
SYSACE_MPCE: sheet U_Banks_7_8/SYSACE_MPCE, sheet U_SysACE_SysFLASH/SYSACE_MPCE
SYSACE_MPIRQ: sheet U_Banks_7_8/SYSACE_MPIRQ, sheet U_SysACE_SysFLASH/SYSACE_MPIRQ
SYSACE_MPOE_USB_RD_N: sheet U_Banks_7_8/SYSACE_MPOE_USB_RD_N, sheet U_SysACE_SysFLASH/SYSACE_MPOE_USB_RD_N
SYSACE_MPWE_USB_WR_N: sheet U_Banks_7_8/SYSACE_MPWE_USB_WR_N, sheet U_SysACE_SysFLASH/SYSACE_MPWE_USB_WR_N
SYSACE_RESET_N: sheet U_SysACE_SysFLASH/SYSACE_RESET_N, sheet U_Watchdog_Reset/SYSACE_RESET_N
SYSCLK_25MHZ: sheet U_Banks_1_2/SYSCLK_25MHZ, sheet U_Clock_distrubution/SYSCLK_25MHZ, sheet U_PHY_RJ45/PHY_CLK25MHz
Temp_HIGH: sheet U_Banks_7_8/Temp_HIGH, sheet U_SysACE_SysFLASH/Temp_HIGH
USERCLK: sheet U_Banks_1_2/USERCLK, sheet U_Clock_distrubution/USERCLK
VME_ACFAIL: sheet U_Banks_9_10/VME_ACFAIL, sheet U_Eurocard VME 6U P1/VME_ACFAIL
VME_AS: sheet U_Banks_9_10/VME_AS, sheet U_Eurocard VME 6U P1/VME_AS
VME_BBSY: sheet U_Banks_9_10/VME_BBSY, sheet U_Eurocard VME 6U P1/VME_BBSY
VME_BCLR: sheet U_Banks_9_10/VME_BCLR, sheet U_Eurocard VME 6U P1/VME_BCLR
VME_BERR: sheet U_Banks_9_10/VME_BERR, sheet U_Eurocard VME 6U P1/VME_BERR
VME_D_OE: sheet U_Banks_7_8/VME_D_OE, sheet U_Eurocard VME 6U P1/VME_D_OE
VME_D_TR: sheet U_Banks_7_8/VME_D_TR, sheet U_Eurocard VME 6U P1/VME_D_TR
VME_DS0: sheet U_Banks_9_10/VME_DS0, sheet U_Eurocard VME 6U P1/VME_DS0
VME_DS1: sheet U_Banks_9_10/VME_DS1, sheet U_Eurocard VME 6U P1/VME_DS1
VME_DTACK: sheet U_Banks_9_10/VME_DTACK, sheet U_Eurocard VME 6U P1/VME_DTACK
VME_IACK: sheet U_Banks_9_10/VME_IACK, sheet U_Eurocard VME 6U P1/VME_IACK
VME_IACKIN: sheet U_Banks_9_10/VME_IACKIN, sheet U_Eurocard VME 6U P1/VME_IACKIN
VME_IACKOUT: sheet U_Banks_9_10/VME_IACKOUT, sheet U_Eurocard VME 6U P1/VME_IACKOUT
VME_LWORD: sheet U_Banks_9_10/VME_LWORD, sheet U_Eurocard VME 6U P1/VME_LWORD
VME_SERA: sheet U_Clock_distrubution/VME_SERA, sheet U_Eurocard VME 6U P1/VME_SERA
VME_SERB: sheet U_Clock_distrubution/VME_SERB, sheet U_Eurocard VME 6U P1/VME_SERB
VME_SYSCLK: sheet U_Clock_distrubution/VME_SYSCLK, sheet U_Eurocard VME 6U P1/VME_SYSCLK
VME_SYSFAIL: sheet U_Power_Delivery/VME_SYSFAIL, sheet U_Eurocard VME 6U P1/VME_SYSFAIL
VME_SYSRESET: sheet U_Eurocard VME 6U P1/VME_SYSRESET, sheet U_Watchdog_Reset/VME_SYSRESET
VME_UD18: sheet U_Clock_distrubution/VME_UD18, sheet U_Eurocard VME 6U P2/VME_UD18
VME_UD19: sheet U_Clock_distrubution/VME_UD19, sheet U_Eurocard VME 6U P2/VME_UD19
VME_WRITE: sheet U_Banks_9_10/VME_WRITE, sheet U_Eurocard VME 6U P1/VME_WRITE
NetU1_F18: sheet U_Banks_3_4/PHY_RXC_RXCLK, sheet U_PHY_RJ45/PHY_RXC_RXCLK
NetU1_H19: sheet U_Banks_3_4/PHY_TXCLK, sheet U_PHY_RJ45/PHY_TXCLK

### Buses and harness runs
bus BP_MASTER[0..5] = sheet U_Banks_7_8/BP_MASTER[0..5] = sheet U_Eurocard VME 6U P2/BP_MASTER[0..5]
bus DDR_BA[0..1] = sheet U_Banks_3_4/DDR_BA[0..1]
bus m1_aux[0..1] = sheet U_Banks_11_12/m1_aux[0..1] = sheet U_Mezz1/m1_aux[0..1]
bus m1_aux[2..4] = sheet U_Banks_13_14/m1_aux[2..4] = sheet U_Mezz1/m1_aux[2..4]
bus m1_clock[1..2] = sheet U_Banks_11_12/m1_clock[1..2] = sheet U_Mezz1/m1_clock[1..2]
bus m1_Comb1_data[0..15] = sheet U_Banks_13_14/m1_Comb1_data[0..15] = sheet U_Mezz1/m1_Comb1_data[0..15]
bus m1_Comb1_s[0..1] = sheet U_Banks_13_14/m1_Comb1_s[0..1] = sheet U_Mezz1/m1_Comb1_s[0..1]
bus m1_Comb2_data[0..15] = sheet U_Banks_13_14/m1_Comb2_data[0..15] = sheet U_Mezz1/m1_Comb2_data[0..15]
bus m1_Comb2_s[0..1] = sheet U_Banks_13_14/m1_Comb2_s[0..1] = sheet U_Mezz1/m1_Comb2_s[0..1]
bus m1_Comb3_data[0..15] = sheet U_Banks_11_12/m1_Comb3_data[0..15] = sheet U_Mezz1/m1_Comb3_data[0..15]
bus m1_Comb3_s[0..1] = sheet U_Banks_11_12/m1_Comb3_s[0..1] = sheet U_Mezz1/m1_Comb3_s[0..1]
bus m1_Comb4_data[0..15] = sheet U_Banks_11_12/m1_Comb4_data[0..15] = sheet U_Mezz1/m1_Comb4_data[0..15]
bus m1_Comb4_s[0..1] = sheet U_Banks_11_12/m1_Comb4_s[0..1] = sheet U_Mezz1/m1_Comb4_s[0..1]
bus m1_DemodA_data[0..14] = sheet U_Banks_13_14/m1_DemodA_data[0..14] = sheet U_Mezz1/m1_DemodA_data[0..14]
bus m1_DemodA_s[0..1] = sheet U_Banks_13_14/m1_DemodA_s[0..1] = sheet U_Mezz1/m1_DemodA_s[0..1]
bus m1_DemodB_data[0..14] = sheet U_Banks_11_12/m1_DemodB_data[0..14] = sheet U_Mezz1/m1_DemodB_data[0..14]
bus m1_DemodB_s[0..1] = sheet U_Banks_11_12/m1_DemodB_s[0..1] = sheet U_Mezz1/m1_DemodB_s[0..1]
bus m1_power_data[0..7] = sheet U_Banks_3_4/m1_power_data[0..7] = sheet U_Mezz1/m1_power_data[0..7]
bus m2_aux[0..1] = sheet U_Banks_11_12/m2_aux[0..1] = sheet U_Mezz2/m2_aux[0..1]
bus m2_aux[2..4] = sheet U_Banks_13_14/m2_aux[2..4] = sheet U_Mezz2/m2_aux[2..4]
bus m2_clock[1..2] = sheet U_Banks_11_12/m2_clock[1..2] = sheet U_Mezz2/m2_clock[1..2]
bus m2_Comb1_data[0..15] = sheet U_Banks_13_14/m2_Comb1_data[0..15] = sheet U_Mezz2/m2_Comb1_data[0..15]
bus m2_Comb1_s[0..1] = sheet U_Banks_13_14/m2_Comb1_s[0..1] = sheet U_Mezz2/m2_Comb1_s[0..1]
bus m2_Comb2_data[0..15] = sheet U_Banks_13_14/m2_Comb2_data[0..15] = sheet U_Mezz2/m2_Comb2_data[0..15]
bus m2_Comb2_s[0..1] = sheet U_Banks_13_14/m2_Comb2_s[0..1] = sheet U_Mezz2/m2_Comb2_s[0..1]
bus m2_Comb3_data[0..15] = sheet U_Banks_11_12/m2_Comb3_data[0..15] = sheet U_Mezz2/m2_Comb3_data[0..15]
bus m2_Comb3_s[0..1] = sheet U_Banks_11_12/m2_Comb3_s[0..1] = sheet U_Mezz2/m2_Comb3_s[0..1]
bus m2_Comb4_data[0..15] = sheet U_Banks_11_12/m2_Comb4_data[0..15] = sheet U_Mezz2/m2_Comb4_data[0..15]
bus m2_Comb4_s[0..1] = sheet U_Banks_11_12/m2_Comb4_s[0..1] = sheet U_Mezz2/m2_Comb4_s[0..1]
bus m2_DemodA_data[0..14] = sheet U_Banks_13_14/m2_DemodA_data[0..14] = sheet U_Mezz2/m2_DemodA_data[0..14]
bus m2_DemodA_s[0..1] = sheet U_Banks_13_14/m2_DemodA_s[0..1] = sheet U_Mezz2/m2_DemodA_s[0..1]
bus m2_DemodB_data[0..14] = sheet U_Banks_11_12/m2_DemodB_data[0..14] = sheet U_Mezz2/m2_DemodB_data[0..14]
bus m2_DemodB_s[0..1] = sheet U_Banks_11_12/m2_DemodB_s[0..1] = sheet U_Mezz2/m2_DemodB_s[0..1]
bus m2_power_data[0..7] = sheet U_Banks_3_4/m2_power_data[0..7] = sheet U_Mezz2/m2_power_data[0..7]
bus POWER_DATA[0..6] = sheet U_Banks_1_2/POWER_DATA[0..6] = sheet U_Housekeeping/POWER_DATA[0..6]
bus SYSACE_MPA[0..6] = sheet U_Banks_7_8/SYSACE_MPA[0..6] = sheet U_SysACE_SysFLASH/SYSACE_MPA[0..6]
bus SYSACE_USB_D[0..15] = sheet U_Banks_7_8/SYSACE_USB_D[0..15] = sheet U_SysACE_SysFLASH/SYSACE_USB_D[0..15]
bus VME_A[1..7] = sheet U_Banks_9_10/VME_A[1..7] = sheet U_Eurocard VME 6U P1/VME_A[1..7]
bus VME_A[8..23] = sheet U_Banks_9_10/VME_A[8..23] = sheet U_Eurocard VME 6U P1/VME_A[8..23]
bus VME_AM[0..5] = sheet U_Banks_9_10/VME_AM[0..5] = sheet U_Eurocard VME 6U P1/VME_AM[0..5]
bus VME_BGIN[0..3] = sheet U_Banks_9_10/VME_BGIN[0..3] = sheet U_Eurocard VME 6U P1/VME_BGIN[0..3]
bus VME_BGOUT[0..3] = sheet U_Banks_9_10/VME_BGOUT[0..3] = sheet U_Eurocard VME 6U P1/VME_BGOUT[0..3]
bus VME_BR[0..3] = sheet U_Banks_9_10/VME_BR[0..3] = sheet U_Eurocard VME 6U P1/VME_BR[0..3]
bus VME_D[0..15] = sheet U_Banks_7_8/VME_D[0..15] = sheet U_Eurocard VME 6U P1/VME_D[0..15]
bus VME_IRQ[1..7] = sheet U_Banks_9_10/VME_IRQ[1..7] = sheet U_Eurocard VME 6U P1/VME_IRQ[1..7]
bus VME_UD[0..17] = sheet U_Banks_7_8/VME_UD[0..17] = sheet U_Eurocard VME 6U P2/VME_UD[0..17]

### Notes on the sheet
- Digital Readout Multiplexer Project, McGill University
- Matt Dobbs (Project Director) <Matt.Dobbs@McGill.ca>
  Nick Starinski (Layout/Altium Schematics, UdeM) <Nick.Starinski@gmail.com>
  George Zizka (Orcad Schematics, LBNL) <mazin@pacbell.net>
  Design and concepts Copyright 2006 M. Dobbs
- McGill Digital fMUX FPGA Motherboard
- Board Block Diagram
- 03
- N.Starinski, UdeM

## Sheet Banks_1_2.SchDoc: FPGA Motherboard for Digital Multiplexed Readout, McGill U.
size Tabloid; DocumentNumber: DfMUX2; Revision: Rev0, Prototype; SheetNumber: 2; SheetTotal: 27; PageSetup: Record=PageOptions|CenterHorizontal=True|CenterVertical=True|PrintScale=0.65|XCorrection=1.00|YCorrection=1.00|PrintKind=0|BorderSize=5000000|LeftOffset=0|BottomOffset=0|Orientation=2|PaperLength=1000|PaperWidth=1000|Scale=100|PaperSource=7|PrintQuality=-4|MediaType=1|DitherType=10|PaperKind=A4|PrintScaleMode=1
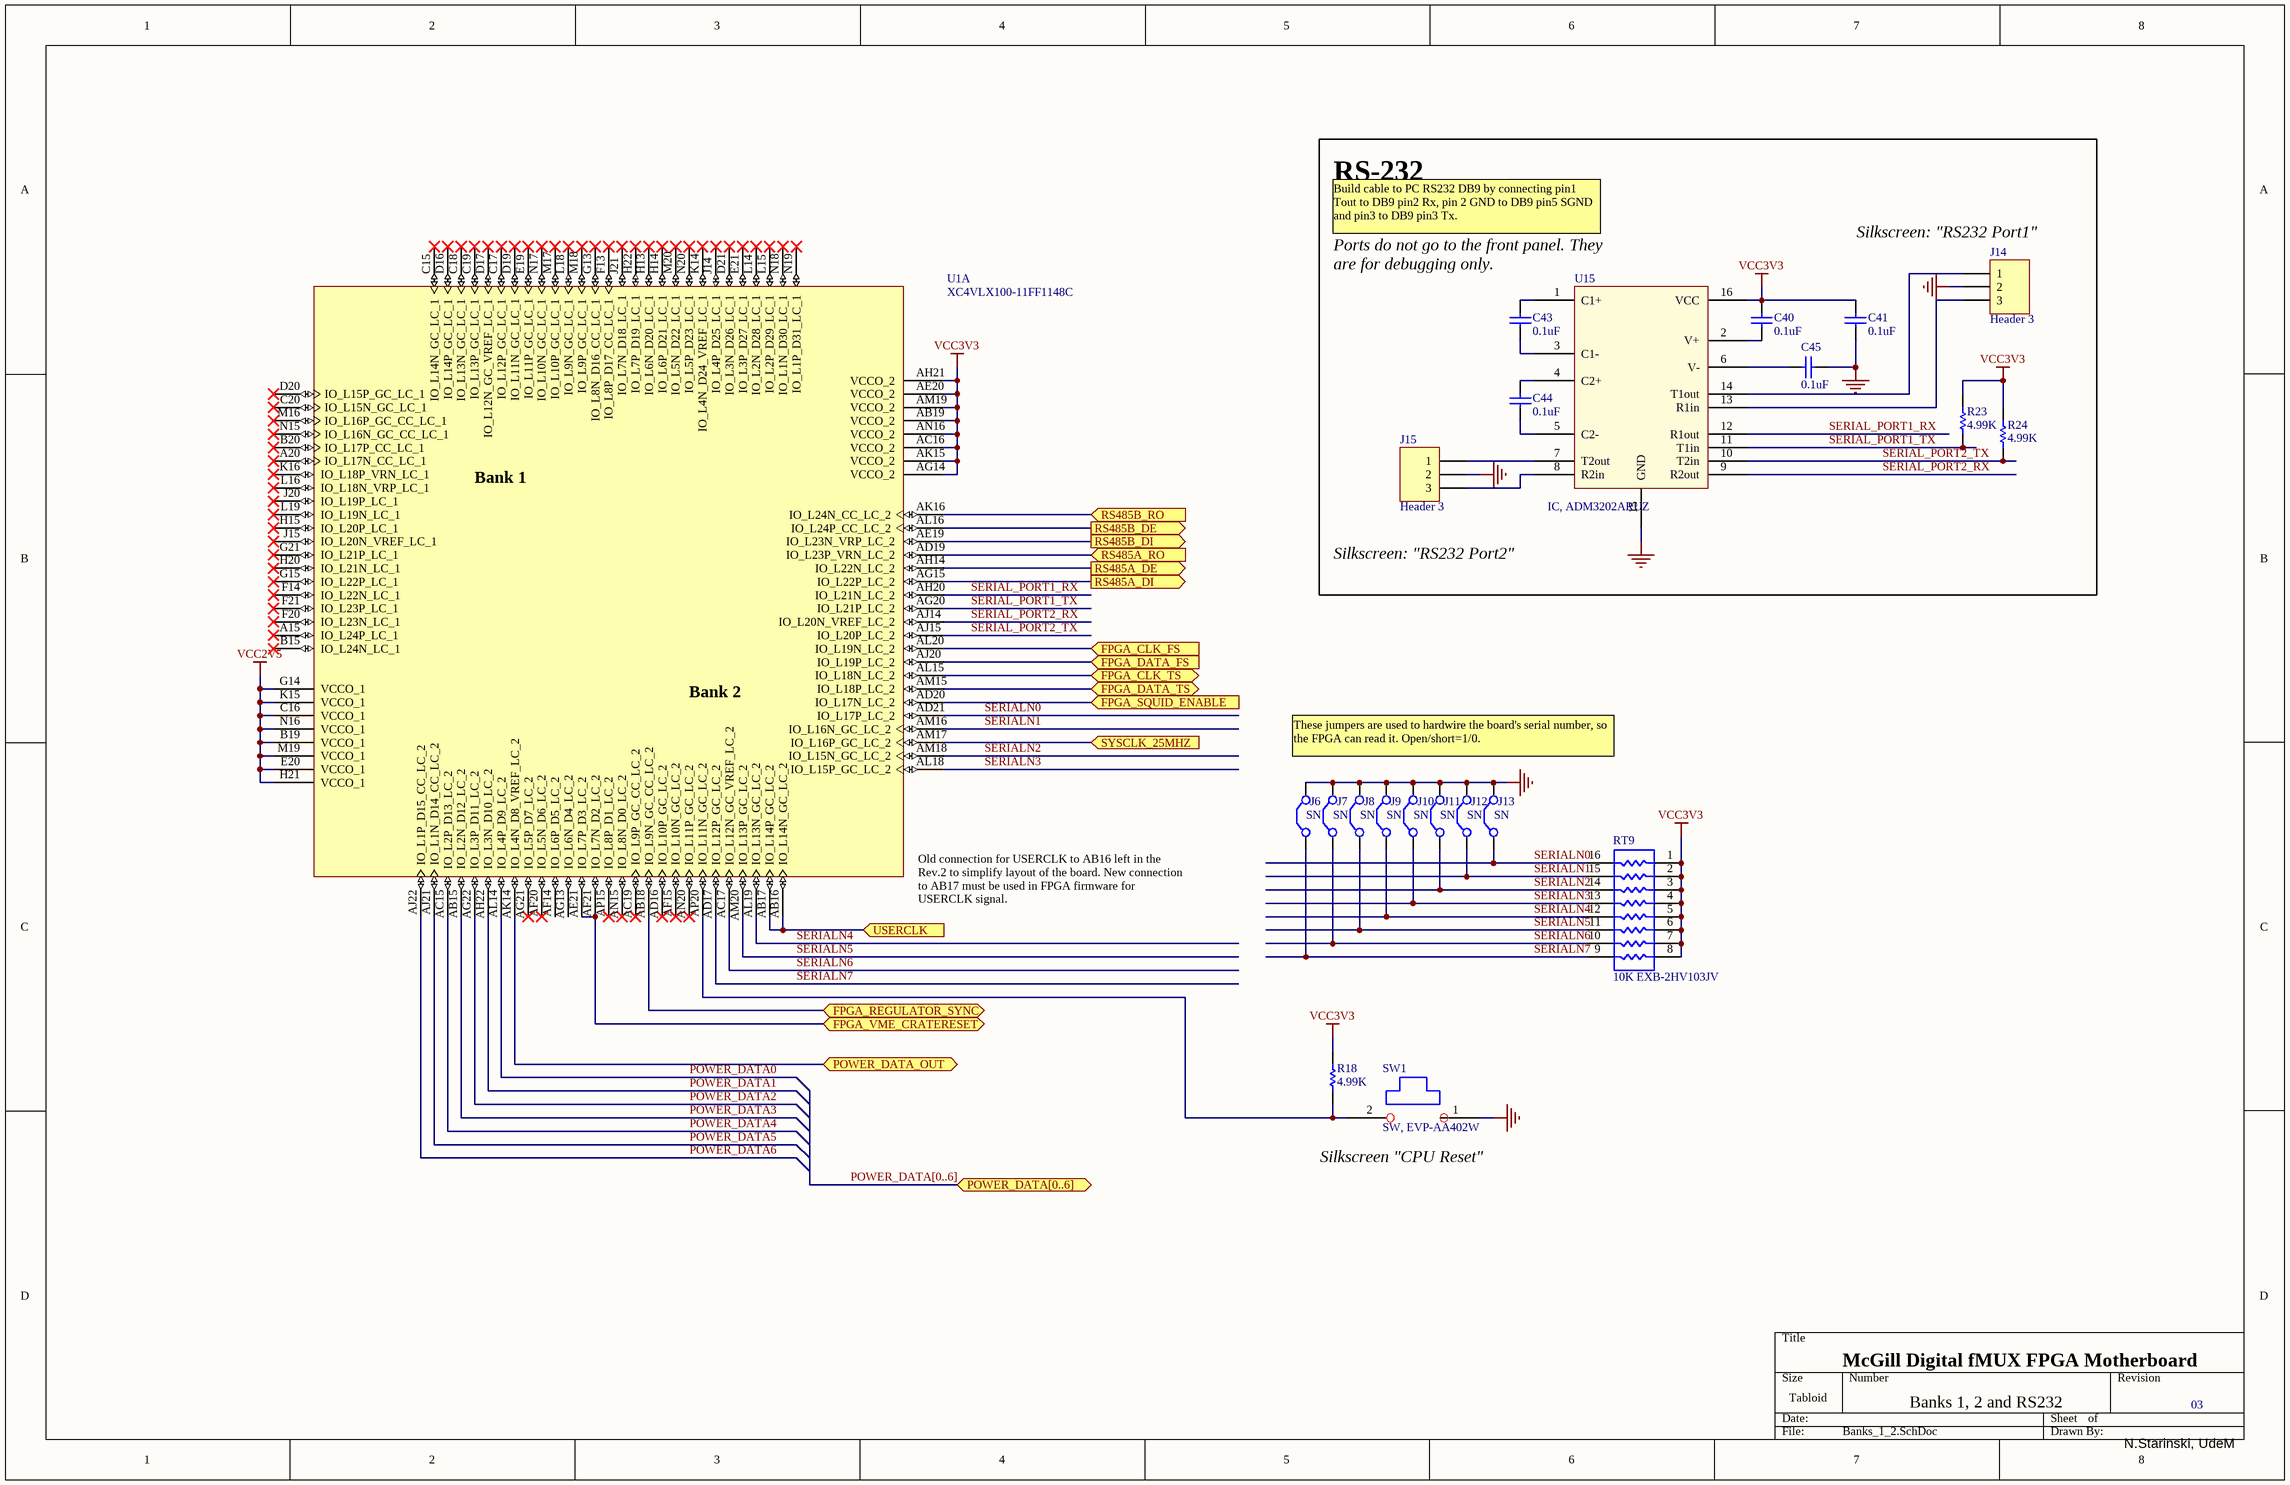
[diagram p1: Banks_1_2.SchDoc]

### Parts
C40  0.1uF  [CC1608-0603]
C41  0.1uF  [CC1608-0603]
C43  0.1uF  [CC1608-0603]
C44  0.1uF  [CC1608-0603]
C45  0.1uF  [CC1608-0603]
J6  SN  [MHDR1X2]
J7  SN  [MHDR1X2]
J8  SN  [MHDR1X2]
J9  SN  [MHDR1X2]
J10  SN  [MHDR1X2]
J11  SN  [MHDR1X2]
J12  SN  [MHDR1X2]
J13  SN  [MHDR1X2]
J14  Header 3  [HDR1X3]
J15  Header 3  [HDR1X3]
R18  4.99K  [CR1608-0603]
R23  4.99K  [CR1608-0603]
R24  4.99K  [CR1608-0603]
RT9  10K EXB-2HV103JV  [0402_Array_2HV]
SW1  SW, EVP-AA402W  [EVPAA]
U1  XC4VLX100-11FF1148C  [FF1148]  (part A of 10)
U15  IC, ADM3202ARUZ  [SSO-G16/X.45]

### Ports
FPGA_CLK_FS (in), FPGA_CLK_TS (bidir), FPGA_DATA_FS (in), FPGA_DATA_TS (bidir), FPGA_REGULATOR_SYNC (bidir), FPGA_SQUID_ENABLE (in), FPGA_VME_CRATERESET (bidir), POWER_DATA[0..6], POWER_DATA_OUT (bidir), RS485A_DE (out), RS485A_DI (out), RS485A_RO (in), RS485B_DE (out), RS485B_DI (out), RS485B_RO (in), SYSCLK_25MHZ (in), USERCLK (in)

### Nets
GND: C41.1 C45.2 J6.2(C2) J7.2(C2) J8.2(C2) J9.2(C2) J10.2(C2) J11.2(C2) J12.2(C2) J13.2(C2) J14.2 J15.2 SW1.1 U15.15(GND)
VCC2V5: U1.B19(VCCO_1) U1.C16(VCCO_1) U1.E20(VCCO_1) U1.G14(VCCO_1) U1.H21(VCCO_1) U1.K15(VCCO_1) U1.M19(VCCO_1) U1.N16(VCCO_1)  [project net Vout2]
VCC3V3: C40.2 C41.2 R18.2 R23.2 R24.2 RT9.1 RT9.2 RT9.3 RT9.4 RT9.5 RT9.6 RT9.7 RT9.8 U1.AB19(VCCO_2) U1.AC16(VCCO_2) U1.AE20(VCCO_2) U1.AG14(VCCO_2) U1.AH21(VCCO_2) U1.AK15(VCCO_2) U1.AM19(VCCO_2) U1.AN16(VCCO_2) U15.16(VCC)
FPGA_CLK_FS: U1.AL20(IO_L19N_LC_2) ; port FPGA_CLK_FS
FPGA_CLK_TS: U1.AL15(IO_L18N_LC_2) ; port FPGA_CLK_TS
FPGA_DATA_FS: U1.AJ20(IO_L19P_LC_2) ; port FPGA_DATA_FS
FPGA_DATA_TS: U1.AM15(IO_L18P_LC_2) ; port FPGA_DATA_TS
FPGA_REGULATOR_SYNC: U1.AB18(IO_L9N_GC_CC_LC_2) ; port FPGA_REGULATOR_SYNC
FPGA_SQUID_ENABLE: U1.AD20(IO_L17N_LC_2) ; port FPGA_SQUID_ENABLE
FVC: U1.AE21(IO_L7P_D3_LC_2) U1.AF21(IO_L7N_D2_LC_2) ; port FPGA_VME_CRATERESET
POWER_DATA0: U1.AL14(IO_L4P_D9_LC_2)
POWER_DATA1: U1.AH22(IO_L3N_D10_LC_2)
POWER_DATA2: U1.AG22(IO_L3P_D11_LC_2)
POWER_DATA3: U1.AB15(IO_L2N_D12_LC_2)  [project net CS1]
POWER_DATA4: U1.AC15(IO_L2P_D13_LC_2)
POWER_DATA5: U1.AJ21(IO_L1N_D14_CC_LC_2)  [project net CS2]
POWER_DATA6: U1.AJ22(IO_L1P_D15_CC_LC_2)  [project net CS3]
POWER_DATA_OUT: U1.AK14(IO_L4N_D8_VREF_LC_2) ; port POWER_DATA_OUT
RS485A_DE: U1.AH14(IO_L22N_LC_2) ; port RS485A_DE
RS485A_DI: U1.AG15(IO_L22P_LC_2) ; port RS485A_DI
RS485A_RO: U1.AD19(IO_L23P_VRN_LC_2) ; port RS485A_RO
RS485B_DE: U1.AL16(IO_L24P_CC_LC_2) ; port RS485B_DE
RS485B_DI: U1.AE19(IO_L23N_VRP_LC_2) ; port RS485B_DI
RS485B_RO: U1.AK16(IO_L24N_CC_LC_2) ; port RS485B_RO
SERIAL_PORT1_RX: U1.AH20(IO_L21N_LC_2) U15.12(R1out)  [project net SERIAL_PORT1_RX_2]
SERIAL_PORT1_TX: R23.1 U1.AG20(IO_L21P_LC_2) U15.11(T1in)  [project net SERIAL_PORT1_TX_2]
SERIAL_PORT2_RX: U1.AJ14(IO_L20N_VREF_LC_2) U15.9(R2out)  [project net SERIAL_PORT2_RX_2]
SERIAL_PORT2_TX: R24.1 U1.AJ15(IO_L20P_LC_2) U15.10(T2in)  [project net SERIAL_PORT2_TX_2]
SERIALN0: J13.1(C1) RT9.16 U1.AD21(IO_L17P_LC_2)  [project net SERIALN0_2]
SERIALN1: J12.1(C1) RT9.15 U1.AM16(IO_L16N_GC_LC_2)  [project net SERIALN1_2]
SERIALN2: J11.1(C1) RT9.14 U1.AM18(IO_L15N_GC_LC_2)  [project net SERIALN2_2]
SERIALN3: J10.1(C1) RT9.13 U1.AL18(IO_L15P_GC_LC_2)  [project net SERIALN3_2]
SERIALN4: J9.1(C1) RT9.12 U1.AL19(IO_L13N_GC_LC_2)  [project net SERIALN4_2]
SERIALN5: J8.1(C1) RT9.11 U1.AM20(IO_L13P_GC_LC_2)  [project net SERIALN5_2]
SERIALN6: J7.1(C1) RT9.10 U1.AC17(IO_L12N_GC_VREF_LC_2)  [project net SERIALN6_2]
SERIALN7: J6.1(C1) RT9.9 U1.AD17(IO_L12P_GC_LC_2)  [project net SERIALN7_2]
SYSCLK_25MHZ: U1.AM17(IO_L16P_GC_LC_2) ; port SYSCLK_25MHZ
USERCLK: U1.AB16(IO_L14N_GC_LC_2) U1.AB17(IO_L14P_GC_LC_2) ; port USERCLK
NetC40_1: C40.1 U15.2(V+)
NetC43_1: C43.1 U15.3(C1-)
NetC43_2: C43.2 U15.1(C1+)
NetC44_1: C44.1 U15.5(C2-)
NetC44_2: C44.2 U15.4(C2+)
NetC45_1: C45.1 U15.6(V-)
NetJ14_1: J14.1 U15.14(T1out)
NetJ14_3: J14.3 U15.13(R1in)
NetJ15_1: J15.1 U15.7(T2out)
NetJ15_3: J15.3 U15.8(R2in)
NetR18_1: R18.1 SW1.2 U1.AP20(IO_L11N_GC_LC_2)

Not connected (* = marked no-connect by the designer): U1 A15(IO_L24P_LC_1)* A20(IO_L17N_CC_LC_1)* AC19(IO_L9P_GC_CC_LC_2)* AD16(IO_L10P_GC_LC_2)* AF14(IO_L6P_D5_LC_2) AF15(IO_L10N_GC_LC_2)* AF20(IO_L5N_D6_LC_2)* AG13(IO_L6N_D4_LC_2) AG21(IO_L5P_D7_LC_2)* AN15(IO_L8N_D0_LC_2)* AN20(IO_L11P_GC_LC_2)* AP15(IO_L8P_D1_LC_2)* B15(IO_L24N_LC_1)* B20(IO_L17P_CC_LC_1)* C15(IO_L14N_GC_LC_1)* C17(IO_L12P_GC_LC_1)* C18(IO_L13N_GC_LC_1)* C19(IO_L13P_GC_LC_1)* C20(IO_L15N_GC_LC_1)* D16(IO_L14P_GC_LC_1)* D17(IO_L12N_GC_VREF_LC_1)* D19(IO_L11N_GC_LC_1)* D20(IO_L15P_GC_LC_1)* D21(IO_L3N_D26_LC_1)* E19(IO_L11P_GC_LC_1)* E21(IO_L3P_D27_LC_1)* F13(IO_L8P_D17_CC_LC_1)* F14(IO_L22N_LC_1)* F20(IO_L23N_LC_1)* F21(IO_L23P_LC_1)* G13(IO_L8N_D16_CC_LC_1)* G15(IO_L22P_LC_1)* G21(IO_L21P_LC_1)* H13(IO_L6N_D20_LC_1)* H14(IO_L6P_D21_LC_1)* H15(IO_L20P_LC_1)* H20(IO_L21N_LC_1)* H22(IO_L7P_D19_LC_1)* J14(IO_L4P_D25_LC_1)* J15(IO_L20N_VREF_LC_1)* J20(IO_L19P_LC_1)* J21(IO_L7N_D18_LC_1)* K14(IO_L4N_D24_VREF_LC_1)* K16(IO_L18P_VRN_LC_1)* L14(IO_L2N_D28_LC_1)* L15(IO_L2P_D29_LC_1)* L16(IO_L18N_VRP_LC_1)* L18(IO_L9N_GC_LC_1)* L19(IO_L19N_LC_1)* M16(IO_L16P_GC_CC_LC_1)* M17(IO_L10P_GC_LC_1)* M18(IO_L9P_GC_LC_1)* M20(IO_L5N_D22_LC_1)* N15(IO_L16N_GC_CC_LC_1)* N17(IO_L10N_GC_LC_1)* N18(IO_L1N_D30_LC_1)* N19(IO_L1P_D31_LC_1)* N20(IO_L5P_D23_LC_1)*

### Buses and harness runs
bus POWER_DATA[0..6] = port POWER_DATA[0..6]

### Notes on the sheet
- RS-232
- Build cable to PC RS232 DB9 by connecting pin1 Tout to DB9 pin2 Rx, pin 2 GND to DB9 pin5 SGND and pin3 to DB9 pin3 Tx.
- Ports do not go to the front panel. They are for debugging only.
- (near J14) Silkscreen: "RS232 Port1"
- Silkscreen: "RS232 Port2"
- These jumpers are used to hardwire the board's serial number, so the FPGA can read it. Open/short=1/0.
- (near U1) Old connection for USERCLK to AB16 left in the Rev.2 to simplify layout of the board. New connection to AB17 must be used in FPGA firmware for USERCLK signal.
- (near SW1) Silkscreen "CPU Reset"
- McGill Digital fMUX FPGA Motherboard
- Banks 1, 2 and RS232
- 03
- N.Starinski, UdeM
- (in symbol XC4VLX100-11FF1148C, part A) Bank 1; Bank 2

### Library data of the parts
C40 C41 C43-C45 = Cap Semi: Capacitor (Semiconductor SIM Model); Published: 8-Jun-2000; LatestRevisionDate: 17-Jul-2002; LatestRevisionNote: Re-released for DXP Platform.; PackageReference: C1206; Publisher: Altium Limited
J6-J13 = Jumper: Jumper Wire - Assembly house please short.; Published: 24-Mar-1999; LatestRevisionDate: 17-Jul-2002; LatestRevisionNote: Re-released for DXP Platform.; Publisher: Altium Limited
J14 J15 = Header 3: Header, 0.1"  3-Pin straight; LatestRevisionDate: 17-Jul-2002; LatestRevisionNote: Re-released for DXP Platform.; Publisher: Altium Limited
R18 R23 R24 = Res Semi: Resistor 0603; Published: 8-Jun-2000; LatestRevisionDate: 17-Jul-2002; LatestRevisionNote: Re-released for DXP Platform.; Publisher: Altium Limited
RT9 = Res Pack3: Isolated Resistor Network; Published: 24-Mar-1999; LatestRevisionDate: 17-Jul-2002; LatestRevisionNote: Re-released for DXP Platform.; Publisher: Altium Limited
SW1 = Tiny Pushbutton Switch: Switch, SM pushbutton SPST
U1 = XC4VLX100-11FF1148C: Xilinx Virtex-4 LX Platform FPGA, 1148-Ball FFBGA, Speed Grade 11, 768 User I/Os, Commercial Grade; PackageDocument: ver1.0, Oct-2002; Published: 13-Dec-2004; LatestRevisionDate: 4-Mar-2005; LatestRevisionNote: D_IN & CS_B pins changed from I/O to Input. DOUT_BUSY pin changed from I/O to Output.; DatasheetDocument: ver1.2, Dec-2004; PackageReference: FF1148; Publisher: Altium Limited; ComponentLink2Description: Virtex-4 Overview; ComponentLink2URL: http://www.xilinx.com/products/virtex4/overview.htm; ComponentLink3Description: Datasheet; ComponentLink3URL: http://direct.xilinx.com/bvdocs/userguides/ug075.pdf; Code_JEDEC: MS-034-AAR-1
U15 = ADM3202: Line Drivers/Receivers

## Sheet Banks_3_4.SchDoc: FPGA Motherboard for Digital Multiplexed Readout, McGill U.
size B; DocumentNumber: DfMUX3; Revision: Rev0, Prototype; SheetNumber: 3; SheetTotal: 27; PageSetup: Record=PageOptions|CenterHorizontal=True|CenterVertical=True|PrintScale=1.08|XCorrection=1.00|YCorrection=1.00|PrintKind=0|BorderSize=5000000|LeftOffset=0|BottomOffset=0|Orientation=2|PaperLength=1000|PaperWidth=1000|Scale=100|PaperSource=7|PrintQuality=-4|MediaType=1|DitherType=10|PaperKind=Tabloid|PrintScaleMode=1
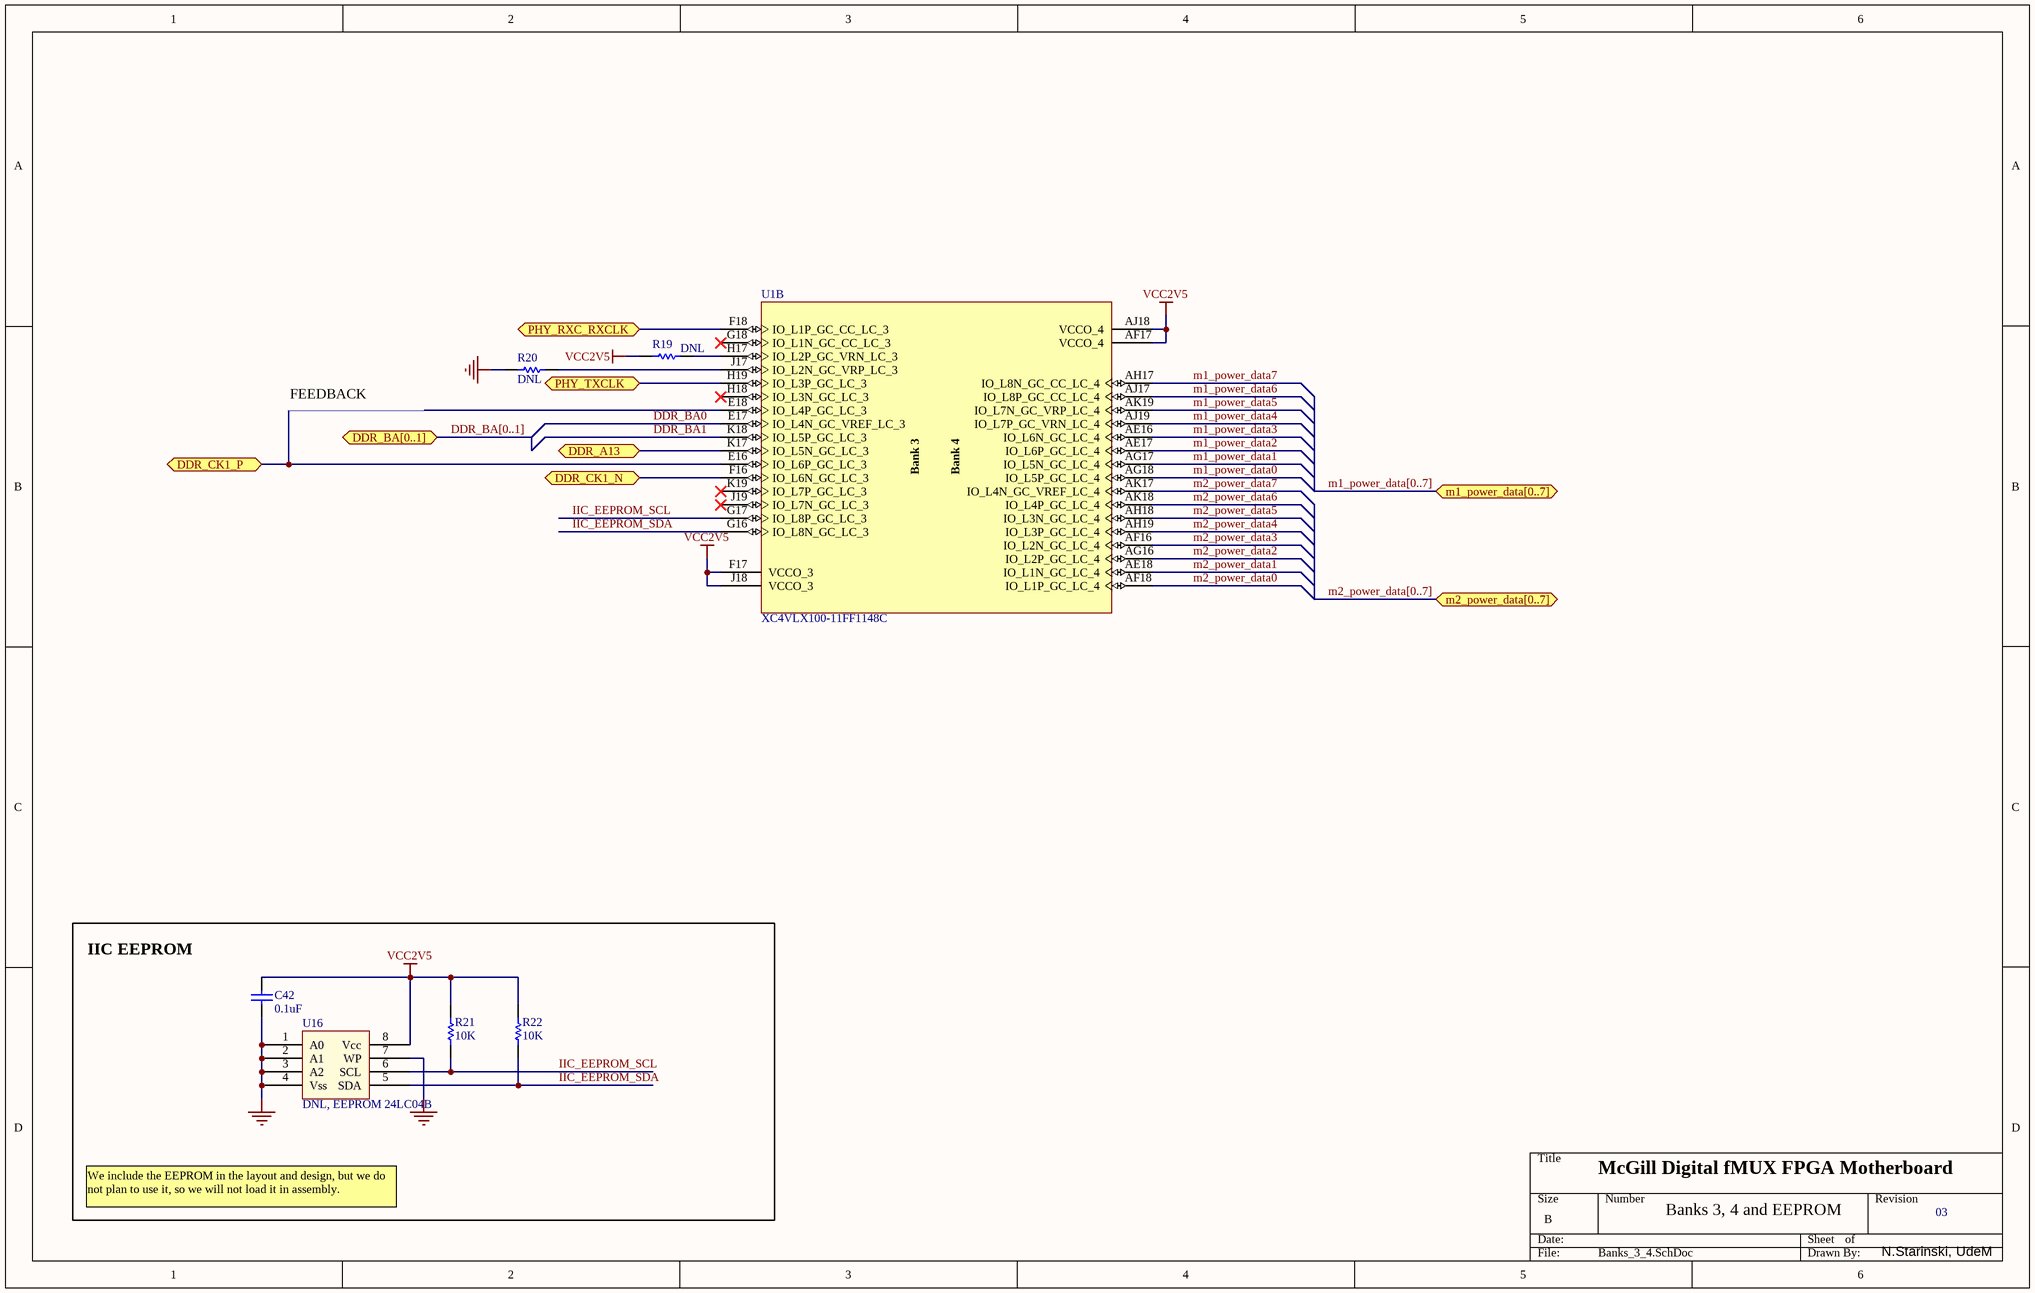
[diagram p2: Banks_3_4.SchDoc]

### Parts
C42  0.1uF  [CC1608-0603]
R19  DNL  [CR1608-0603]
R20  DNL  [CR1608-0603]
R21  10K  [CR1608-0603]
R22  10K  [CR1608-0603]
U1  XC4VLX100-11FF1148C  [FF1148]  (part B of 10)
U16  DNL, EEPROM 24LC04B  [TSSOP8-4.4]

### Ports
DDR_A13 (bidir), DDR_BA[0..1] (bidir), DDR_CK1_N (bidir), DDR_CK1_P (bidir), m1_power_data[0..7], m2_power_data[0..7] (bidir), PHY_RXC_RXCLK (bidir), PHY_TXCLK (bidir)

### Nets
GND: C42.1 R20.1 U16.1(A0) U16.2(A1) U16.3(A2) U16.4(Vss) U16.7(WP)
VCC2V5: C42.2 R19.1 R21.2 R22.2 U1.AF17(VCCO_4) U1.AJ18(VCCO_4) U1.F17(VCCO_3) U1.J18(VCCO_3) U16.8(Vcc)  [project net Vout2]
DDR_A13: U1.K17(IO_L5N_GC_LC_3) ; port DDR_A13
DDR_BA0: U1.E17(IO_L4N_GC_VREF_LC_3)
DDR_BA1: U1.K18(IO_L5P_GC_LC_3)
DDR_CK1_N: U1.F16(IO_L6N_GC_LC_3) ; port DDR_CK1_N
DDR_CK1_P: U1.E16(IO_L6P_GC_LC_3) U1.E18(IO_L4P_GC_LC_3) ; port DDR_CK1_P
IIC_EEPROM_SCL: R21.1 U1.G17(IO_L8P_GC_LC_3) U16.6(SCL)  [project net IIC_EEPROM_SCL_3]
IIC_EEPROM_SDA: R22.1 U1.G16(IO_L8N_GC_LC_3) U16.5(SDA)  [project net IIC_EEPROM_SDA_3]
m1_power_data0: U1.AG18(IO_L5P_GC_LC_4)
m1_power_data1: U1.AG17(IO_L5N_GC_LC_4)
m1_power_data2: U1.AE17(IO_L6P_GC_LC_4)
m1_power_data3: U1.AE16(IO_L6N_GC_LC_4)
m1_power_data4: U1.AJ19(IO_L7P_GC_VRN_LC_4)
m1_power_data5: U1.AK19(IO_L7N_GC_VRP_LC_4)
m1_power_data6: U1.AJ17(IO_L8P_GC_CC_LC_4)
m1_power_data7: U1.AH17(IO_L8N_GC_CC_LC_4)
m2_power_data0: U1.AF18(IO_L1P_GC_LC_4)
m2_power_data1: U1.AE18(IO_L1N_GC_LC_4)
m2_power_data2: U1.AG16(IO_L2P_GC_LC_4)
m2_power_data3: U1.AF16(IO_L2N_GC_LC_4)
m2_power_data4: U1.AH19(IO_L3P_GC_LC_4)
m2_power_data5: U1.AH18(IO_L3N_GC_LC_4)
m2_power_data6: U1.AK18(IO_L4P_GC_LC_4)
m2_power_data7: U1.AK17(IO_L4N_GC_VREF_LC_4)
NetR19_2: R19.2 U1.H17(IO_L2P_GC_VRN_LC_3)
NetR20_2: R20.2 U1.J17(IO_L2N_GC_VRP_LC_3)
NetU1_F18: U1.F18(IO_L1P_GC_CC_LC_3) ; port PHY_RXC_RXCLK
NetU1_H19: U1.H19(IO_L3P_GC_LC_3) ; port PHY_TXCLK

Not connected (* = marked no-connect by the designer): U1 G18(IO_L1N_GC_CC_LC_3)* H18(IO_L3N_GC_LC_3)* J19(IO_L7N_GC_LC_3)* K19(IO_L7P_GC_LC_3)*

### Buses and harness runs
bus DDR_BA[0..1] = port DDR_BA[0..1]
bus m1_power_data[0..7] = port m1_power_data[0..7]
bus m2_power_data[0..7] = port m2_power_data[0..7]

### Notes on the sheet
- FEEDBACK
- (near C42) IIC EEPROM
- McGill Digital fMUX FPGA Motherboard
- We include the EEPROM in the layout and design, but we do not plan to use it, so we will not load it in assembly.
- Banks 3, 4 and EEPROM
- 03
- N.Starinski, UdeM
- (in symbol XC4VLX100-11FF1148C, part B) Bank 3; Bank 4

### Library data of the parts
C42 = Cap Semi: Capacitor (Semiconductor SIM Model); Published: 8-Jun-2000; LatestRevisionDate: 17-Jul-2002; LatestRevisionNote: Re-released for DXP Platform.; PackageReference: C1206; Publisher: Altium Limited
R19 R20 = Res Semi: Semiconductor Resistor; Published: 8-Jun-2000; LatestRevisionDate: 17-Jul-2002; LatestRevisionNote: Re-released for DXP Platform.; Publisher: Altium Limited
R21 R22 = Res Semi: Resistor 0603; Published: 8-Jun-2000; LatestRevisionDate: 17-Jul-2002; LatestRevisionNote: Re-released for DXP Platform.; Publisher: Altium Limited
U1 = XC4VLX100-11FF1148C: as U1 on sheet Banks_1_2; Published: 13-Dec-2004; LatestRevisionDate: 4-Mar-2005; LatestRevisionNote: D_IN & CS_B pins changed from I/O to Input. DOUT_BUSY pin changed from I/O to Output.; DatasheetDocument: ver1.2, Dec-2004; PackageReference: FF1148; Publisher: Altium Limited; ComponentLink2Description: Virtex-4 Overview; ComponentLink2URL: http://www.xilinx.com/products/virtex4/overview.htm; ComponentLink3Description: Datasheet; ComponentLink3URL: http://direct.xilinx.com/bvdocs/userguides/ug075.pdf; Code_JEDEC: MS-034-AAR-1
U16 = 24AA04/24LC04B: 4K I2C Serial EEPROM

## Sheet Banks_5_6.SchDoc: FPGA Motherboard for Digital Multiplexed Readout, McGill U.
size B; DocumentNumber: DfMUX4; Revision: Rev0, Prototype; SheetNumber: 4; SheetTotal: 27; PageSetup: Record=PageOptions|CenterHorizontal=True|CenterVertical=True|PrintScale=1.08|XCorrection=1.00|YCorrection=1.00|PrintKind=0|BorderSize=5000000|LeftOffset=0|BottomOffset=0|Orientation=2|PaperLength=1000|PaperWidth=1000|Scale=100|PaperSource=7|PrintQuality=-4|MediaType=1|DitherType=10|PaperKind=Tabloid|PrintScaleMode=1
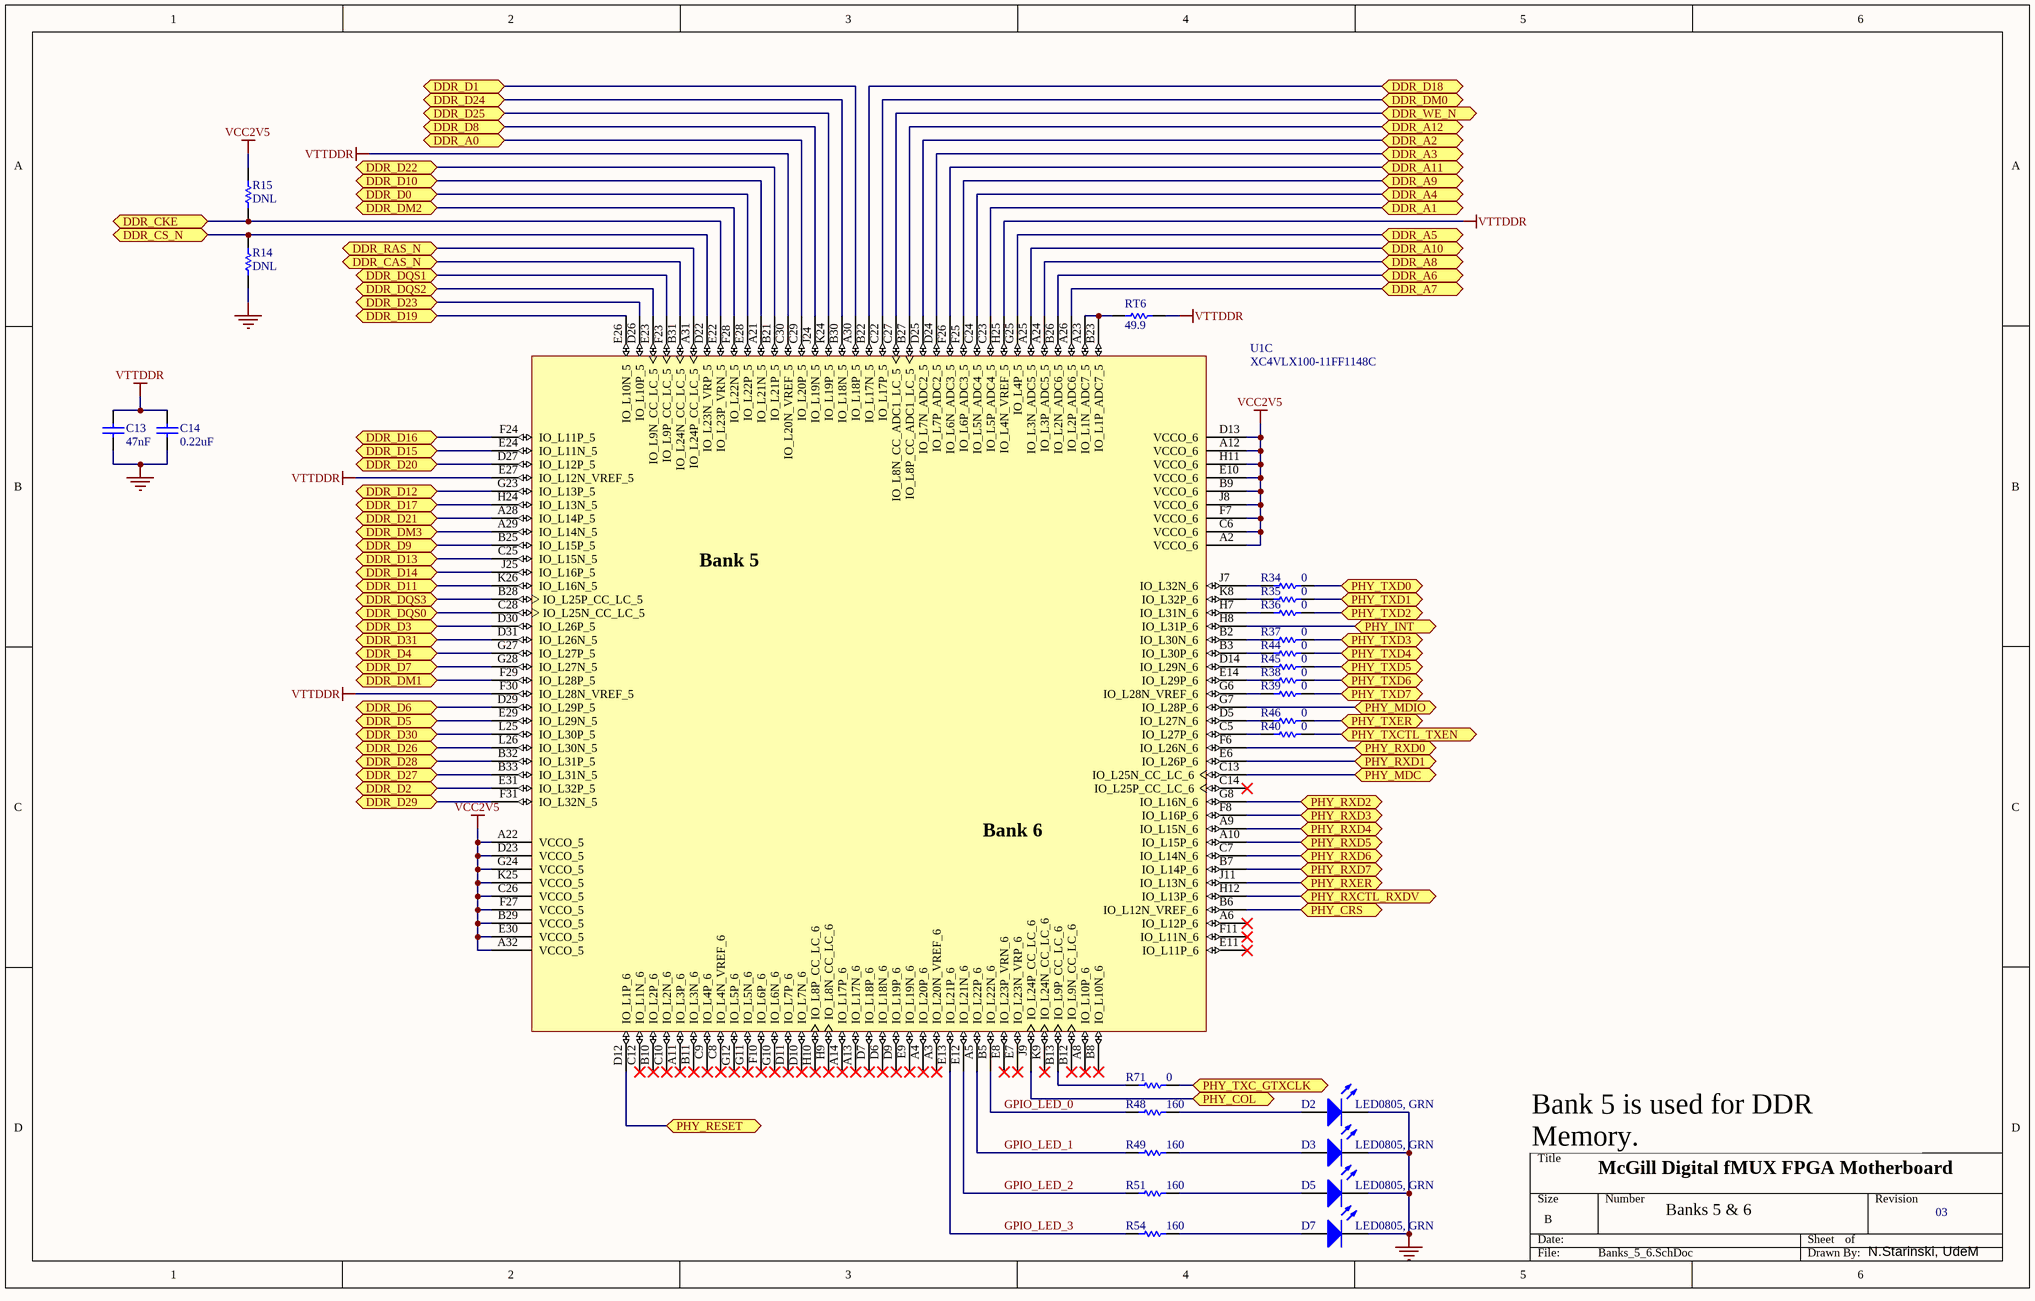
[diagram p3: Banks_5_6.SchDoc]

### Parts
C13  47nF  [CC1005-0402]
C14  0.22uF  [CC1608-0603]
D2  LED0805, GRN  [SMD _LED]
D3  LED0805, GRN  [SMD _LED]
D5  LED0805, GRN  [SMD _LED]
D7  LED0805, GRN  [SMD _LED]
R14  DNL  [CR1608-0603]
R15  DNL  [CR1608-0603]
R34  0  [CR1608-0603]
R35  0  [CR1608-0603]
R36  0  [CR1608-0603]
R37  0  [CR1608-0603]
R38  0  [CR1608-0603]
R39  0  [CR1608-0603]
R40  0  [CR1608-0603]
R44  0  [CR1608-0603]
R45  0  [CR1608-0603]
R46  0  [CR1608-0603]
R48  160  [CR1608-0603]
R49  160  [CR1608-0603]
R51  160  [CR1608-0603]
R54  160  [CR1608-0603]
R71  0  [CR1608-0603]
RT6  49.9  [CR1608-0603]
U1  XC4VLX100-11FF1148C  [FF1148]  (part C of 10)

### Ports
DDR_A0 (bidir), DDR_A1 (bidir), DDR_A2 (bidir), DDR_A3 (bidir), DDR_A4 (bidir), DDR_A5 (bidir), DDR_A6 (bidir), DDR_A7 (bidir), DDR_A8 (bidir), DDR_A9 (bidir), DDR_A10 (bidir), DDR_A11 (bidir), DDR_A12 (bidir), DDR_CAS_N (bidir), DDR_CKE (bidir), DDR_CS_N (bidir), DDR_D0 (bidir), DDR_D1 (bidir), DDR_D2 (bidir), DDR_D3 (bidir), DDR_D4 (bidir), DDR_D5 (bidir), DDR_D6 (bidir), DDR_D7 (bidir), DDR_D8 (bidir), DDR_D9 (bidir), DDR_D10 (bidir), DDR_D11 (bidir), DDR_D12 (bidir), DDR_D13 (bidir), DDR_D14 (bidir), DDR_D15 (bidir), DDR_D16 (bidir), DDR_D17 (bidir), DDR_D18 (bidir), DDR_D19 (bidir), DDR_D20 (bidir), DDR_D21 (bidir), DDR_D22 (bidir), DDR_D23 (bidir), DDR_D24 (bidir), DDR_D25 (bidir), DDR_D26 (bidir), DDR_D27 (bidir), DDR_D28 (bidir), DDR_D29 (bidir), DDR_D30 (bidir), DDR_D31 (bidir), DDR_DM0 (bidir), DDR_DM1 (bidir), DDR_DM2 (bidir), DDR_DM3 (bidir), DDR_DQS0 (bidir), DDR_DQS1 (bidir), DDR_DQS2 (bidir), DDR_DQS3 (bidir), DDR_RAS_N (bidir), DDR_WE_N (bidir), PHY_COL (bidir), PHY_CRS (bidir), PHY_INT (bidir), PHY_MDC (bidir), PHY_MDIO (bidir), PHY_RESET (bidir), PHY_RXCTL_RXDV (bidir), PHY_RXD0 (bidir), PHY_RXD1 (bidir), PHY_RXD2 (bidir), PHY_RXD3 (bidir), PHY_RXD4 (bidir), PHY_RXD5 (bidir), PHY_RXD6 (bidir), PHY_RXD7 (bidir), PHY_RXER (bidir), PHY_TXC_GTXCLK (bidir), PHY_TXCTL_TXEN (bidir), PHY_TXD0 (bidir), PHY_TXD1 (bidir), PHY_TXD2 (bidir), PHY_TXD3 (bidir), PHY_TXD4 (bidir), PHY_TXD5 (bidir), PHY_TXD6 (bidir), PHY_TXD7 (bidir), PHY_TXER (bidir)

### Nets
GND: C13.1 C14.1 D2.2(K) D3.2(K) D5.2(K) D7.2(K) R14.1
VCC2V5: R15.2 U1.A2(VCCO_6) U1.A12(VCCO_6) U1.A22(VCCO_5) U1.A32(VCCO_5) U1.B9(VCCO_6) U1.B29(VCCO_5) U1.C6(VCCO_6) U1.C26(VCCO_5) U1.D13(VCCO_6) U1.D23(VCCO_5) U1.E10(VCCO_6) U1.E30(VCCO_5) U1.F7(VCCO_6) U1.F27(VCCO_5) U1.G24(VCCO_5) U1.H11(VCCO_6) U1.J8(VCCO_6) U1.K25(VCCO_5)  [project net Vout2]
VTTDDR: C13.2 C14.2 RT6.2 U1.C30(IO_L20N_VREF_5) U1.E27(IO_L12N_VREF_5) U1.F30(IO_L28N_VREF_5) U1.H25(IO_L4N_VREF_5)
DDR_A0: U1.C29(IO_L20P_5) ; port DDR_A0
DDR_A1: U1.C23(IO_L5P_ADC4_5) ; port DDR_A1
DDR_A2: U1.D25(IO_L7N_ADC2_5) ; port DDR_A2
DDR_A3: U1.D24(IO_L7P_ADC2_5) ; port DDR_A3
DDR_A4: U1.C24(IO_L5N_ADC4_5) ; port DDR_A4
DDR_A5: U1.G25(IO_L4P_5) ; port DDR_A5
DDR_A6: U1.B26(IO_L2N_ADC6_5) ; port DDR_A6
DDR_A7: U1.A26(IO_L2P_ADC6_5) ; port DDR_A7
DDR_A8: U1.A24(IO_L3P_ADC5_5) ; port DDR_A8
DDR_A9: U1.F25(IO_L6P_ADC3_5) ; port DDR_A9
DDR_A10: U1.A25(IO_L3N_ADC5_5) ; port DDR_A10
DDR_A11: U1.F26(IO_L6N_ADC3_5) ; port DDR_A11
DDR_A12: U1.B27(IO_L8P_CC_ADC1_LC_5) ; port DDR_A12
DDR_CAS_N: U1.B31(IO_L24N_CC_LC_5) ; port DDR_CAS_N
DDR_CKE: R15.1 U1.E22(IO_L23P_VRN_5) ; port DDR_CKE
DDR_CS_N: R14.2 U1.D22(IO_L23N_VRP_5) ; port DDR_CS_N
DDR_D0: U1.E28(IO_L22P_5) ; port DDR_D0
DDR_D1: U1.A30(IO_L18P_5) ; port DDR_D1
DDR_D2: U1.E31(IO_L32P_5) ; port DDR_D2
DDR_D3: U1.D30(IO_L26P_5) ; port DDR_D3
DDR_D4: U1.G27(IO_L27P_5) ; port DDR_D4
DDR_D5: U1.E29(IO_L29N_5) ; port DDR_D5
DDR_D6: U1.D29(IO_L29P_5) ; port DDR_D6
DDR_D7: U1.G28(IO_L27N_5) ; port DDR_D7
DDR_D8: U1.J24(IO_L19N_5) ; port DDR_D8
DDR_D9: U1.B25(IO_L15P_5) ; port DDR_D9
DDR_D10: U1.A21(IO_L21N_5) ; port DDR_D10
DDR_D11: U1.K26(IO_L16N_5) ; port DDR_D11
DDR_D12: U1.G23(IO_L13P_5) ; port DDR_D12
DDR_D13: U1.C25(IO_L15N_5) ; port DDR_D13
DDR_D14: U1.J25(IO_L16P_5) ; port DDR_D14
DDR_D15: U1.E24(IO_L11N_5) ; port DDR_D15
DDR_D16: U1.F24(IO_L11P_5) ; port DDR_D16
DDR_D17: U1.H24(IO_L13N_5) ; port DDR_D17
DDR_D18: U1.B22(IO_L17N_5) ; port DDR_D18
DDR_D19: U1.E26(IO_L10N_5) ; port DDR_D19
DDR_D20: U1.D27(IO_L12P_5) ; port DDR_D20
DDR_D21: U1.A28(IO_L14P_5) ; port DDR_D21
DDR_D22: U1.B21(IO_L21P_5) ; port DDR_D22
DDR_D23: U1.D26(IO_L10P_5) ; port DDR_D23
DDR_D24: U1.B30(IO_L18N_5) ; port DDR_D24
DDR_D25: U1.K24(IO_L19P_5) ; port DDR_D25
DDR_D26: U1.L26(IO_L30N_5) ; port DDR_D26
DDR_D27: U1.B33(IO_L31N_5) ; port DDR_D27
DDR_D28: U1.B32(IO_L31P_5) ; port DDR_D28
DDR_D29: U1.F31(IO_L32N_5) ; port DDR_D29
DDR_D30: U1.L25(IO_L30P_5) ; port DDR_D30
DDR_D31: U1.D31(IO_L26N_5) ; port DDR_D31
DDR_DM0: U1.C22(IO_L17P_5) ; port DDR_DM0
DDR_DM1: U1.F29(IO_L28P_5) ; port DDR_DM1
DDR_DM2: U1.F28(IO_L22N_5) ; port DDR_DM2
DDR_DM3: U1.A29(IO_L14N_5) ; port DDR_DM3
DDR_DQS0: U1.C28(IO_L25N_CC_LC_5) ; port DDR_DQS0
DDR_DQS1: U1.F23(IO_L9P_CC_LC_5) ; port DDR_DQS1
DDR_DQS2: U1.E23(IO_L9N_CC_LC_5) ; port DDR_DQS2
DDR_DQS3: U1.B28(IO_L25P_CC_LC_5) ; port DDR_DQS3
DDR_RAS_N: U1.A31(IO_L24P_CC_LC_5) ; port DDR_RAS_N
DDR_WE_N: U1.C27(IO_L8N_CC_ADC1_LC_5) ; port DDR_WE_N
GPIO_LED_0: R48.1 U1.B5(IO_L22N_6)  [project net GPIO_LED_0_4]
GPIO_LED_1: R49.1 U1.A5(IO_L22P_6)  [project net GPIO_LED_1_4]
GPIO_LED_2: R51.1 U1.E12(IO_L21N_6)  [project net GPIO_LED_2_4]
GPIO_LED_3: R54.1 U1.E13(IO_L21P_6)  [project net GPIO_LED_3_4]
PHY_COL: U1.J9(IO_L24P_CC_LC_6) ; port PHY_COL
PHY_CRS: U1.B6(IO_L12N_VREF_6) ; port PHY_CRS
PHY_INT: U1.H8(IO_L31P_6) ; port PHY_INT
PHY_MDC: U1.C13(IO_L25N_CC_LC_6) ; port PHY_MDC
PHY_MDIO: U1.G7(IO_L28P_6) ; port PHY_MDIO
PHY_RESET: U1.D12(IO_L1P_6) ; port PHY_RESET
PHY_RXCTL_RXDV: U1.H12(IO_L13P_6) ; port PHY_RXCTL_RXDV
PHY_RXD0: U1.F6(IO_L26N_6) ; port PHY_RXD0
PHY_RXD1: U1.E6(IO_L26P_6) ; port PHY_RXD1
PHY_RXD2: U1.G8(IO_L16N_6) ; port PHY_RXD2
PHY_RXD3: U1.F8(IO_L16P_6) ; port PHY_RXD3
PHY_RXD4: U1.A9(IO_L15N_6) ; port PHY_RXD4
PHY_RXD5: U1.A10(IO_L15P_6) ; port PHY_RXD5
PHY_RXD6: U1.C7(IO_L14N_6) ; port PHY_RXD6
PHY_RXD7: U1.B7(IO_L14P_6) ; port PHY_RXD7
PHY_RXER: U1.J11(IO_L13N_6) ; port PHY_RXER
PHY_TXC_GTXCLK: R71.2 ; port PHY_TXC_GTXCLK
PHY_TXCTL_TXEN: R40.2 ; port PHY_TXCTL_TXEN
PHY_TXD0: R34.2 ; port PHY_TXD0
PHY_TXD1: R35.2 ; port PHY_TXD1
PHY_TXD2: R36.2 ; port PHY_TXD2
PHY_TXD3: R37.2 ; port PHY_TXD3
PHY_TXD4: R44.2 ; port PHY_TXD4
PHY_TXD5: R45.2 ; port PHY_TXD5
PHY_TXD6: R38.2 ; port PHY_TXD6
PHY_TXD7: R39.2 ; port PHY_TXD7
PHY_TXER: R46.2 ; port PHY_TXER
NetD2_1: D2.1(A) R48.2
NetD3_1: D3.1(A) R49.2
NetD5_1: D5.1(A) R51.2
NetD7_1: D7.1(A) R54.2
NetR34_1: R34.1 U1.J7(IO_L32N_6)
NetR35_1: R35.1 U1.K8(IO_L32P_6)
NetR36_1: R36.1 U1.H7(IO_L31N_6)
NetR37_1: R37.1 U1.B2(IO_L30N_6)
NetR38_1: R38.1 U1.E14(IO_L29P_6)
NetR39_1: R39.1 U1.G6(IO_L28N_VREF_6)
NetR40_1: R40.1 U1.C5(IO_L27P_6)
NetR44_1: R44.1 U1.B3(IO_L30P_6)
NetR45_1: R45.1 U1.D14(IO_L29N_6)
NetR46_1: R46.1 U1.D5(IO_L27N_6)
NetR71_1: R71.1 U1.B13(IO_L9P_CC_LC_6)
NetRT6_1: RT6.1 U1.A23(IO_L1N_ADC7_5) U1.B23(IO_L1P_ADC7_5)

Not connected (* = marked no-connect by the designer): U1 A3(IO_L20N_VREF_6)* A4(IO_L20P_6)* A6(IO_L12P_6)* A8(IO_L10P_6)* A11(IO_L3P_6)* A13(IO_L17N_6)* A14(IO_L17P_6)* B8(IO_L10N_6)* B10(IO_L2P_6)* B11(IO_L3N_6)* B12(IO_L9N_CC_LC_6)* C8(IO_L4N_VREF_6)* C9(IO_L4P_6)* C10(IO_L2N_6)* C12(IO_L1N_6)* C14(IO_L25P_CC_LC_6)* D6(IO_L18N_6)* D7(IO_L18P_6)* D9(IO_L19P_6)* D10(IO_L7N_6)* D11(IO_L7P_6)* E7(IO_L23N_VRP_6)* E8(IO_L23P_VRN_6)* E9(IO_L19N_6)* E11(IO_L11P_6)* F10(IO_L6P_6)* F11(IO_L11N_6)* G10(IO_L6N_6)* G11(IO_L5N_6)* G12(IO_L5P_6)* H9(IO_L8N_CC_LC_6)* H10(IO_L8P_CC_LC_6)* K9(IO_L24N_CC_LC_6)*

### Notes on the sheet
- Bank 5 is used for DDR Memory.
  Bank 6 is used for PHY.
- McGill Digital fMUX FPGA Motherboard
- Banks 5 & 6
- 03
- N.Starinski, UdeM
- (in symbol XC4VLX100-11FF1148C, part C) Bank 5; Bank 6

### Library data of the parts
C13 C14 = Cap Semi: Capacitor (Semiconductor SIM Model); Published: 8-Jun-2000; LatestRevisionDate: 17-Jul-2002; LatestRevisionNote: Re-released for DXP Platform.; PackageReference: C1206; Publisher: Altium Limited
D2 D3 D5 D7 = LED3: LED 0805 LTST-C170GKT; Published: 8-Jun-2000; LatestRevisionDate: 17-Dec-2003; LatestRevisionNote: PCB Footprint replaced.; Publisher: Altium Limited
R14 R15 = Res Semi: Semiconductor Resistor; Published: 8-Jun-2000; LatestRevisionDate: 17-Jul-2002; LatestRevisionNote: Re-released for DXP Platform.; Publisher: Altium Limited
R34-R40 R44-R46 R48 R49 R51 R54 R71 RT6 = Res Semi: Resistor 0603; Published: 8-Jun-2000; LatestRevisionDate: 17-Jul-2002; LatestRevisionNote: Re-released for DXP Platform.; Publisher: Altium Limited
U1 = XC4VLX100-11FF1148C: as U1 on sheet Banks_1_2; Published: 13-Dec-2004; LatestRevisionDate: 4-Mar-2005; LatestRevisionNote: D_IN & CS_B pins changed from I/O to Input. DOUT_BUSY pin changed from I/O to Output.; DatasheetDocument: ver1.2, Dec-2004; PackageReference: FF1148; Publisher: Altium Limited; ComponentLink2Description: Virtex-4 Overview; ComponentLink2URL: http://www.xilinx.com/products/virtex4/overview.htm; ComponentLink3Description: Datasheet; ComponentLink3URL: http://direct.xilinx.com/bvdocs/userguides/ug075.pdf; Code_JEDEC: MS-034-AAR-1